# Altium project CAMERA.PrjPcb (part 1 of 3)
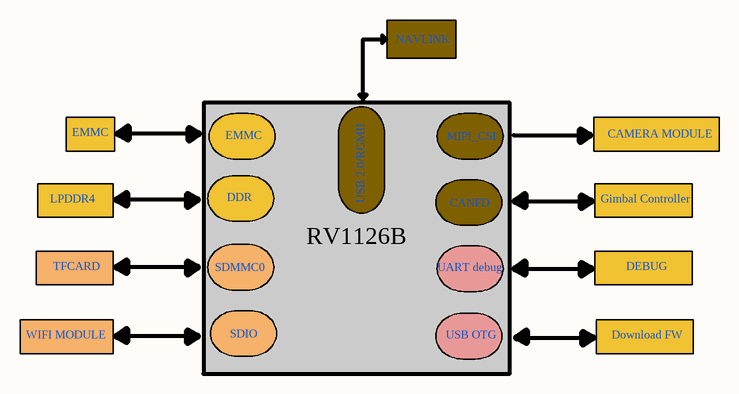
[diagram p0: Block Diagram.SchDoc]
21 sheets, 318 parts. Net scope: global (net labels, ports and power ports of the same name join across sheets).
Board file: CAMERA.PcbDoc
Sheets:
  Block Diagram.SchDoc
  Power Blocks Diagram.SchDoc
  PWR_IN.SchDoc
  PMIC.SchDoc
  Power Pins Page RV1126.SchDoc
  PMUIO_BLOCK.SchDoc
  SDRAM RV1126B.SchDoc
  LPDDR4X SDRAM.SchDoc
  RV1126B EMMC.SchDoc
  EMMC CHIP.SchDoc
  SDMMC RV1126B.SchDoc
  SDCARD.SchDoc
  SDMMC1.SchDoc
  SARADC.SchDoc
  USB 2.0 CONTROLLER.SchDoc
  CANFD.SchDoc
  MIPI_CSI.SchDoc
  RGMII.SchDoc
  RGMII_PHY.SchDoc
  Connector.SchDoc
  OTHER.SchDoc

## Sheet Block Diagram.SchDoc: Interface Block Diagram
size A4; DrawnBy: ThanhQuoc; Revision: V01; SheetNumber: 1; SheetTotal: 18; Project: RV1126 CAMERA BOARD DESIGN

### Notes on the sheet
- NAVLINK
- EMMC
- MIPI_CSI
- CAMERA MODULE
- LPDDR4
- DDR
- USB 2.0/RGMII
- CANFD
- Gimbal Controller
- TFCARD
- SDMMC0
- RV1126B
- UART debug
- DEBUG
- WIFI MODULE
- SDIO
- USB OTG
- Download FW
- Title:
- Drawn By:
- Page Contents:
- Checked By:
- Size:
- Date:
- File:
- License:
- Email:
- A4
- nguyenthanhquoc0206@gmail.com
- Number:
- Time:
- Revision:
- Sheet
- Website:
- of
- https://www.facebook.com/ntq.687

## Sheet Power Blocks Diagram.SchDoc: POWER BLOCKS DIAGRAM
size A4; DrawnBy: ThanhQuoc; Revision: V01; SheetNumber: 2; SheetTotal: 4; Project: RV1126 CAMERA BOARD DESIGN
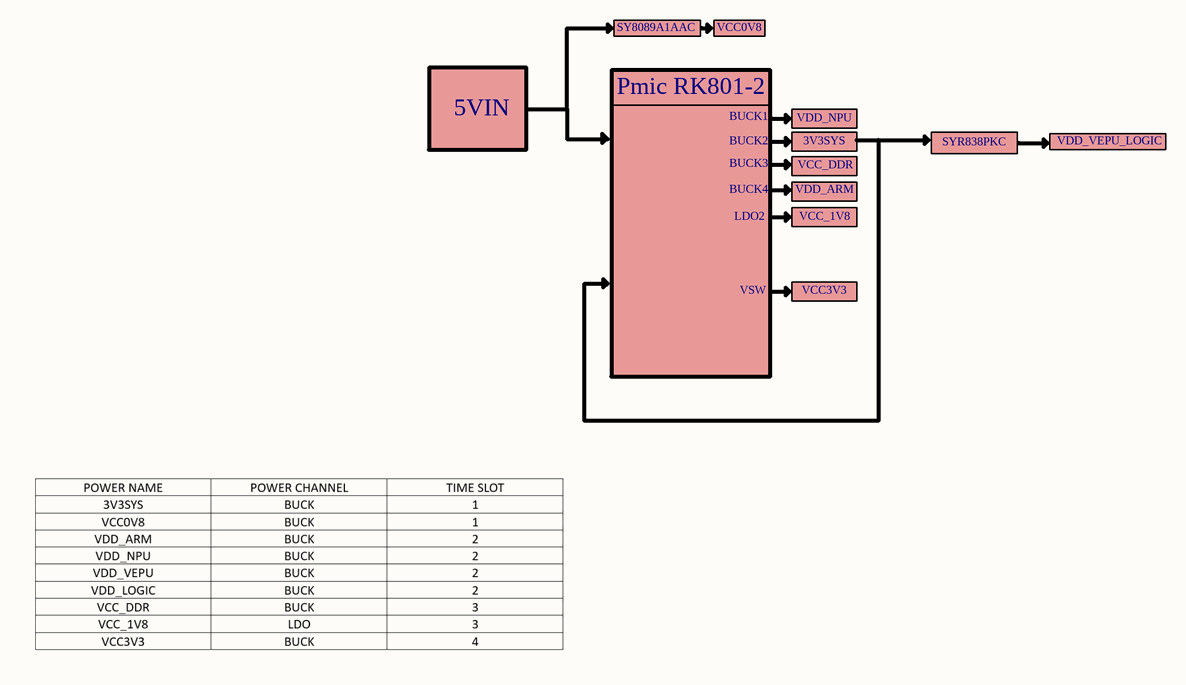
[diagram p1: Power Blocks Diagram.SchDoc]

### Notes on the sheet
- SY8089A1AAC
- VCC0V8
- 5VIN
- Pmic RK801-2
- BUCK1
- BUCK2
- VDD_NPU
- 3V3SYS
- SYR838PKC
- VDD_VEPU_LOGIC
- BUCK3
- BUCK4
- VDD_ARM
- VCC_DDR
- LDO2
- VCC_1V8
- VSW
- VCC3V3
- Title:
- Drawn By:
- Page Contents:
- Checked By:
- Size:
- Date:
- File:
- License:
- Email:
- A4
- nguyenthanhquoc0206@gmail.com
- Number:
- Time:
- Revision:
- Sheet
- Website:
- of
- https://www.facebook.com/ntq.687

## Sheet PWR_IN.SchDoc: POWER
size A4; DrawnBy: ThanhQuoc; Organization: ORGANIZATION; Address1: ADDRESS 1; Address2: ADDRESS 2; Address3: ADDRESS 3; Address4: ADDRESS 4; Revision: V01; SheetNumber: 3; SheetTotal: 21; Project: RV1126 CAMERA BOARD DESIGN; ENG_APP_DATE: --/--/--; DSN_APP_DATE: --/--/--; ImagePath: "C:\Users\Admin\Downloads\Gemini_Generated_Image_ajh2r8ajh2r8ajh2.png"
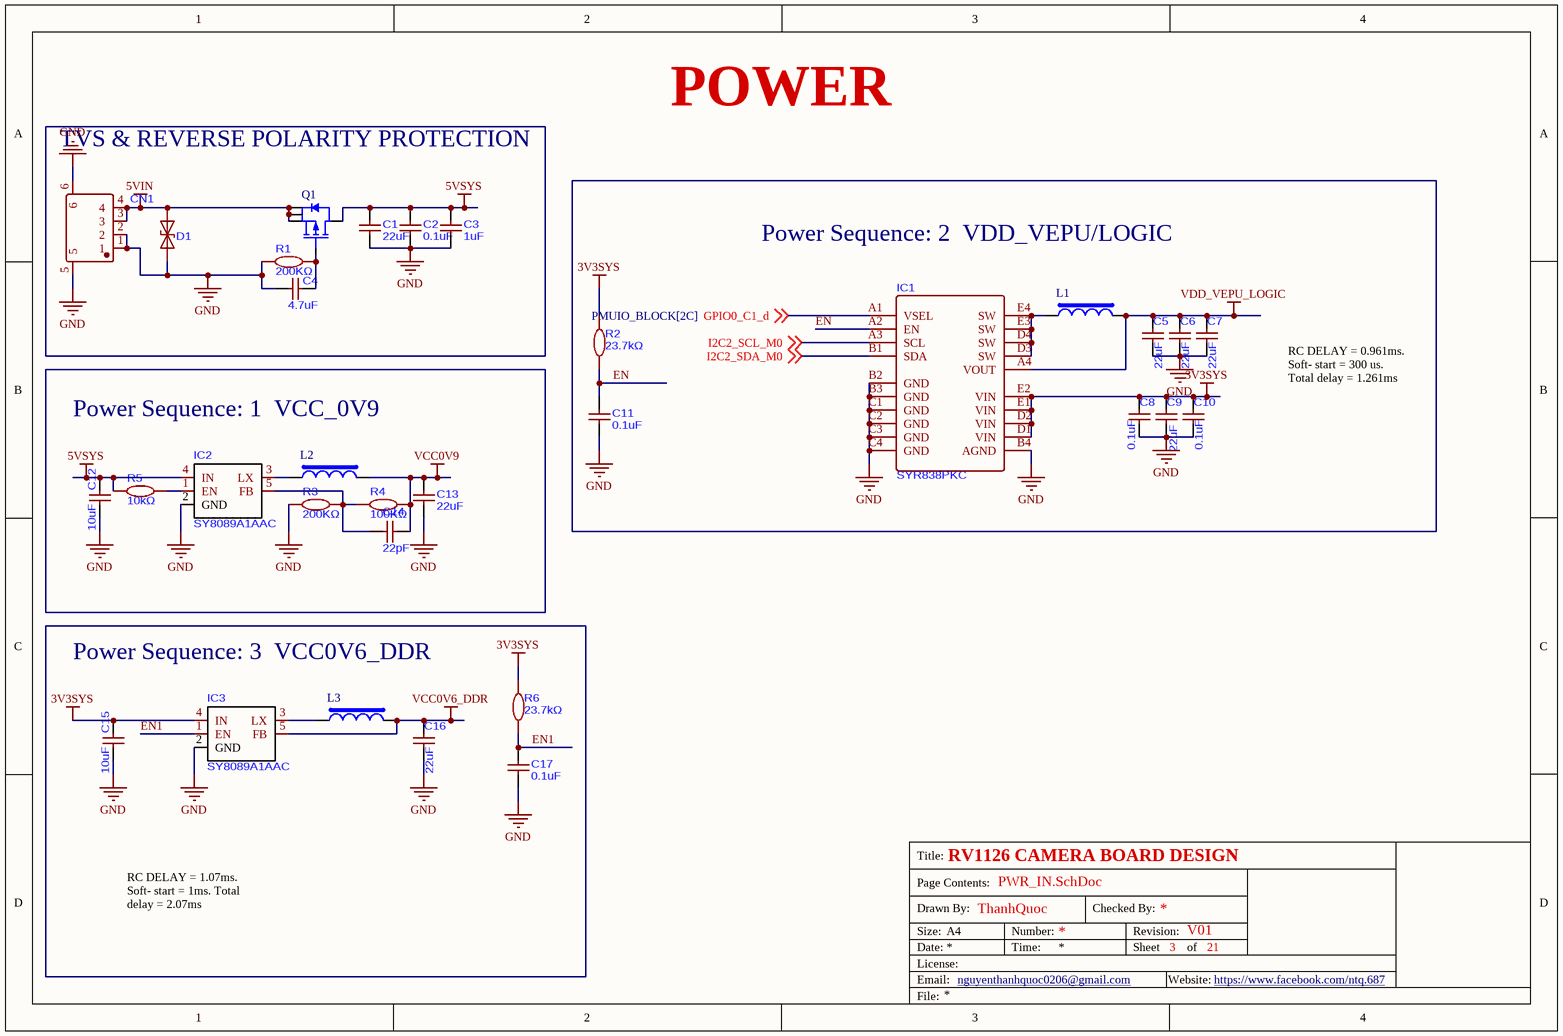
[diagram p2: PWR_IN.SchDoc]

### Parts
C1  22uF  [C0603]
C2  0.1uF  [C0201]
C3  1uF  [C0201]
C4  4.7uF  [C0402]
C5  22uF  [C0402]
C6  22uF  [C0402]
C7  22uF  [C0402]
C8  0.1uF  [C0201]
C9  22uF  [C0603]
C10  0.1uF  [C0201]
C11  0.1uF  [C0201]
C12  10uF  [C0402]
C13  22uF  [C0402]
C14  22pF  [C0201]
C15  10uF  [C0402]
C16  22uF  [C0402]
C17  0.1uF  [C0201]
CN1  SMD,P=2mm,Surface Mount,Right Angle  [CONN-SMD_4P-P2.00_WTBA0-BH004]  (value not drawn)
D1  TVS DIODE 5VWM 10VC X1-SON-2(0.6x1)  [X1SON-2_L1.0-W0.6-P0.65-BI-1]  (value not drawn)
IC1  SYR838PKC  [BGA-20_L15.6-W2.0-R4-C6-P0.40-BL]
IC2  SY8089A1AAC  [SOT-23-5_L3.0-W1.7-P0.95-LS2.8-BR]
IC3  SY8089A1AAC  [SOT-23-5_L3.0-W1.7-P0.95-LS2.8-BR]
L1  FTC252012SR47MBCA  [IND_1008]  (value not drawn)
L2  APH252012C1R0MP01  [IND_1008]  (value not drawn)
L3  APH252012C1R0MP01  [IND_1008]  (value not drawn)
Q1  SI7615CDN-T1-GE3  [PowerPAK_1212-8_SMD]  (value not drawn)
R1  200KΩ  [R0201]
R2  23.7kΩ  [R0402]
R3  200KΩ  [R0201]
R4  100KΩ  [R0201]
R5  10kΩ  [R0201]
R6  23.7kΩ  [R0402]

### Nets
3V3SYS: C8.2 C9.2 C10.2 C15.2 IC1.D1(VIN) IC1.D2(VIN) IC1.E1(VIN) IC1.E2(VIN) IC3.4(IN) R2.2 R6.2
5VIN: CN1.3 CN1.4 D1.2(A) Q1.1(S) Q1.2(S) Q1.3(S)
5VSYS: C1.2 C2.2 C3.2 C12.2 IC2.4(IN) Q1.5(D) R5.1
GND: C1.1 C2.1 C3.1 C4.2 C5.1 C6.1 C7.1 C8.1 C9.1 C10.1 C11.1 C12.1 C13.1 C15.1 C16.1 C17.1 CN1.1 CN1.2 CN1.5 CN1.6 D1.1(K) IC1.B2(GND) IC1.B3(GND) IC1.B4(AGND) IC1.C1(GND) IC1.C2(GND) IC1.C3(GND) IC1.C4(GND) IC2.2(GND) IC3.2(GND) R1.1 R3.1
VCC0V6_DDR: C16.2 IC3.5(FB) L3.2
VCC0V9: C13.2 C14.2 L2.2 R4.2
VDD_VEPU_LOGIC: C5.2 C6.2 C7.2 IC1.A4(VOUT) L1.2
EN: C11.2 IC1.A2(EN) R2.1
EN1: C17.2 IC3.1(EN) R6.1
GPIO0_C1_d: IC1.A1(VSEL) ; off-sheet GPIO0_C1_d
I2C2_SCL_M0: IC1.A3(SCL) ; off-sheet I2C2_SCL_M0  [project net SCL]
I2C2_SDA_M0: IC1.B1(SDA) ; off-sheet I2C2_SDA_M0  [project net SDA]
NetC4_1: C4.1 Q1.4(G) R1.2
NetC14_1: C14.1 IC2.5(FB) R3.2 R4.1
NetIC1_D3: IC1.D3(SW) IC1.D4(SW) IC1.E3(SW) IC1.E4(SW) L1.1
NetIC2_1: IC2.1(EN) R5.2
NetIC2_3: IC2.3(LX) L2.1
NetIC3_3: IC3.3(LX) L3.1

### Notes on the sheet
- TVS & REVERSE POLARITY PROTECTION
- Power Sequence: 2  VDD_VEPU/LOGIC
- Power Sequence: 1  VCC_0V9
- RC DELAY = 0.961ms. Soft- start = 300 us. Total delay = 1.261ms
- Power Sequence: 3  VCC0V6_DDR
- RC DELAY = 1.07ms. Soft- start = 1ms. Total delay = 2.07ms
- Title:
- Drawn By:
- Page Contents:
- Checked By:
- Size:
- Date:
- File:
- License:
- Email:
- A4
- nguyenthanhquoc0206@gmail.com
- Number:
- Time:
- Revision:
- Sheet
- Website:
- of
- https://www.facebook.com/ntq.687

### Library data of the parts
C1 = CAP_22uF-25V-20%-0603: 22uF ±20% 25V Ceramic Capacitor X5R 0603
C2 C8 C10 C11 C17 = CAP_100nF-16V-10%-0201: CAP CER 100nF 16V X5R 0201
C3 = CAP_1uF-10V-10%-0201: 1uF ±10% 10V Ceramic Capacitor X5R 0201
C4 = CAP_4.7uF-16V-10%-0402: 4.7uF ±10% 16V Ceramic Capacitor X5R 0402
C5-C7 C13 C16 = CAP_22uF-10V-20%-0402: 22uF X5R ±20% 10V 0402 Ceramic Capacitors RoHS; ComponentLink1Description: LCSC; ComponentLink1URL: https://www.lcsc.com/product-detail/C385994.html?s_z=n_q_t_22UF&spm=wm.fly.bg.2.xh___wm.ssy.tc.2.tz&lcsc_vid=EwRWBFZSQVIPVFdUTlJfVldeFFRYUFQAElRYBFRRE1MxVlNeRFZbX1BRRVlbVDsOAxUeFF5JWBYZEEoKFBINSQcJGk4NBhADEA4cHktXRlhXSQwSGg0%3D
C9 = CAP_22uF-16V-20%-0603: 22uF ±20% 16V Ceramic Capacitor X5R 0603
C12 C15 = CAP_10uF-10V-20%-0402: 10µF ±20% 10V Ceramic Capacitor X5R 0402 (1005 Metric)
C14 = CAP_22pF-50V-5%-0201: CAP CER 22pF 50V NP0 0201
CN1 = 5023520401: DuraClik(MX 2.0) 125V 4 1 2mm 3A Surface Mount, Right Angle Tin -40℃~+105℃ 4P Black 1x4P SMD,P=2mm,Surface Mount,Right Angle Headers, Male Pins RoHS
D1 = LTVS8H5.0CAT5G
IC1 = SYR838PKC: High-efficiency 5.5V, 6A, 2.4MHz synchronous buck regulator
IC2 IC3 = SY8089A1AAC: High Efficiency, 1.5MHz, 2A Synchronous Step Down Regulator; ComponentLink1Description: LCSC; ComponentLink1URL: https://www.lcsc.com/product-detail/C479074.html?s_z=n_q_SY8089A&spm=wm.fly.bg.0.xh&lcsc_vid=EwRWBFZSQVIPVFdUTlJfVldeFFRYUFQAElRYBFRRE1MxVlNeRVlcV1JUT1FeXzsOAxUeFF5JWBYZEEoKFBINSQcJGk4NBhADEA4cHktXR1NXSQwSGg0%3D
L1 = IND_470nH-6.5A-20%-1008: FIXED IND 0.47uH 6.5A 13mΩ SMD,2x2.5mm; Manufacturer: Murata Electronics; Manufacturer Part Number: DFE252010P-R47M=P2; Case/Package: 1008; Supplier-1: Digikey
L2 L3 = IND_1uH-4A-20%-1008: FIXED IND 01uH 4A 35mΩ SMD,2x2.5mm; Manufacturer: Murata Electronics; Manufacturer Part Number: DFE252010P-R47M=P2; Case/Package: 1008; Supplier-1: Digikey
Q1 = SI7615CDN-T1-GE3-MS: 22W 20V 60A 700mV 7mΩ@4.5V 1 P-Channel P-Channel DFN-8L(3x3) Single FETs, MOSFETs RoHS; Manufacturer: Vishay Siliconix; Manufacturer Part Number: SI7615CDN-T1-GE3; Case/Package: PowerPAK® 1212-8; Supplier-1: Digikey
R1 R3 = RES_200K-50mW-1%-0201: RES 200kΩ ±1% 50mW 0201
R2 R6 = RES_23.7K-0.063W-0.1%-0402: RES 23700Ω ±0.1% 0.063W 0402; ComponentLink1Description: LCSC; ComponentLink1URL: https://www.lcsc.com/product-detail/C2076022.html?s_z=n_q_t_23.7K&spm=wm.fly.bg.0.xh___wm.ssy.tc.0.tz&lcsc_vid=EwRWBFZSQVIPVFdUTlJfVldeFFRYUFQAElRYBFRRE1MxVlNeRFdWV1xeQVRYUzsOAxUeFF5JWBYZEEoKFBINSQcJGk4NBhADEA4cHktXR1NXSQwSGg0%3D
R4 = RES_100K-50mW-1%-0201: RES 100kΩ ±1% 50mW 0201; ComponentLink1Description: LCSC; ComponentLink1URL: https://www.lcsc.com/product-detail/C295718.html?s_z=n_q_t_120%2520OHM&spm=wm.fly.bg.5.xh___wm.ssy.tc.1.tz&lcsc_vid=EwRWBFZSQVIPVFdUTlJfVldeFFRYUFQAElRYBFRRE1MxVlNeRFZeU1BfTlBYVzsOAxUeFF5JWBYZEEoKFBINSQcJGk4eFQsCAgIaSgADAwAHC0slRVhcV1ZTT08GEwkK
R5 = RES_10K-50mW-1%-0201: RES 10KΩ ±1% 50mW 0201; ComponentLink1Description: LCSC; ComponentLink1URL: https://www.lcsc.com/product-detail/C93949.html?spm=wm.fly.bg.0.xh&lcsc_vid=EwRWBFZSQVIPVFdUTlJfVldeFFRYUFQAElRYBFRRE1MxVlNeRVlXUFNQQ1RWXjsOAxUeFF5JWBYZEEoKFBINSQcJGk4eFQsCAgIaSgADAwAHC0slRlVYUFFIHxUDCw%3D%3D

## Sheet PMIC.SchDoc: PMIC
size A4; DrawnBy: ThanhQuoc; Revision: V01; SheetNumber: 4; SheetTotal: 21; Project: RV1126 CAMERA BOARD DESIGN
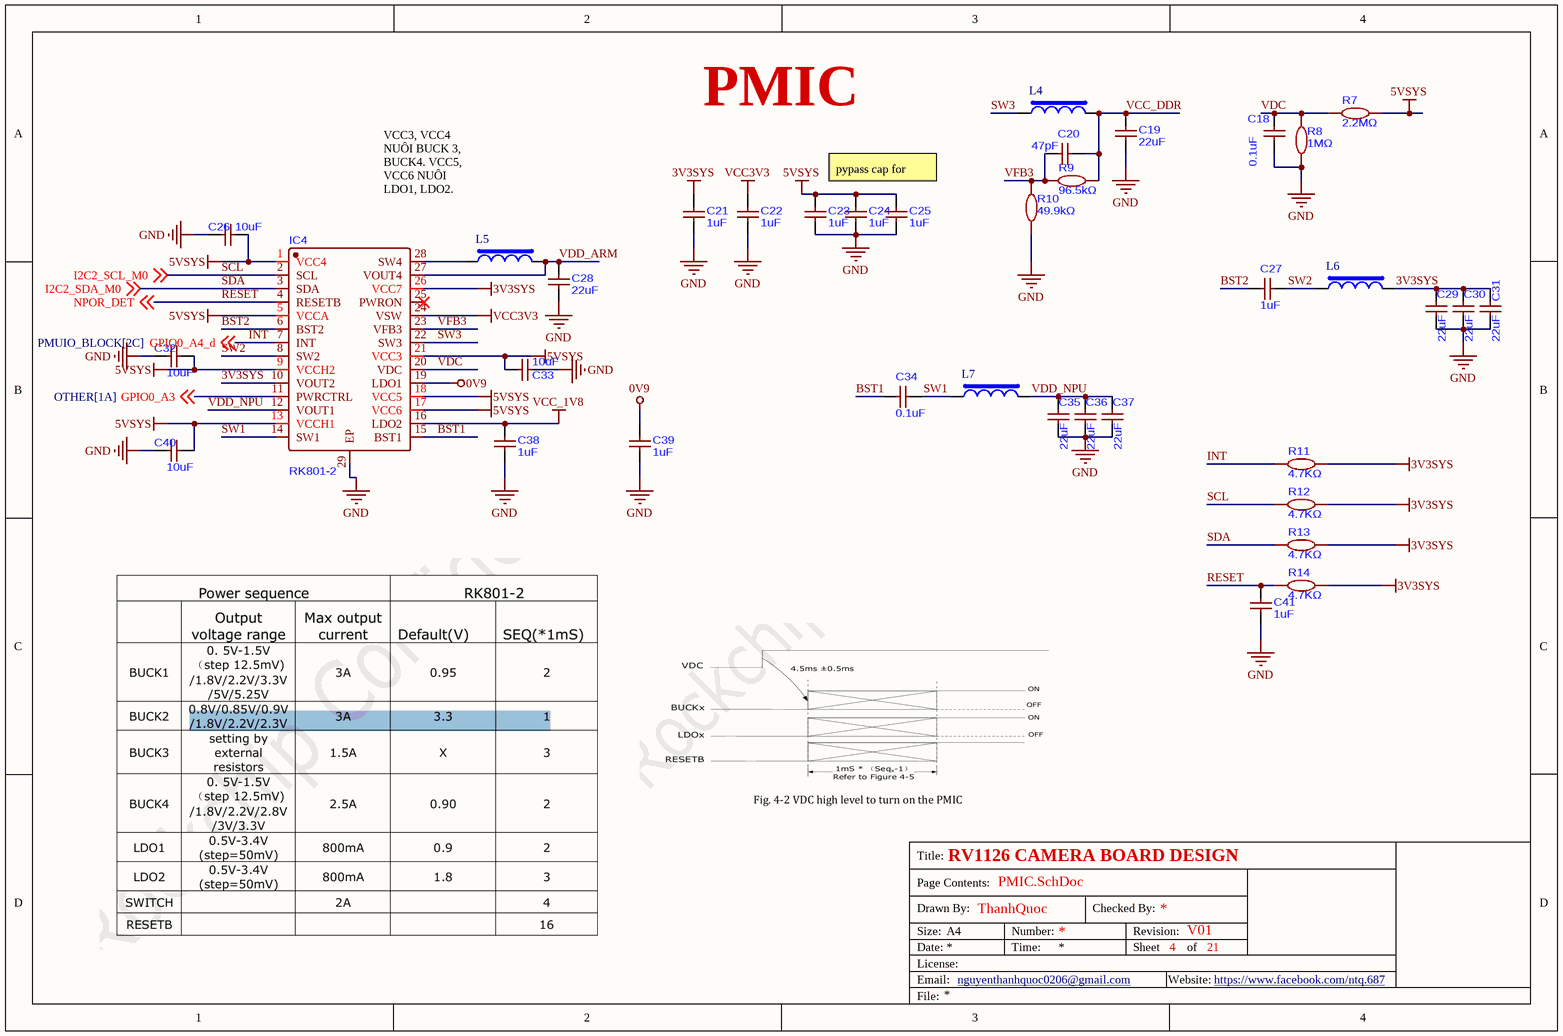
[diagram p3: PMIC.SchDoc]

### Parts
C18  0.1uF  [C0201]
C19  22uF  [C0603]
C20  47pF  [C0201]
C21  1uF  [C0201]
C22  1uF  [C0201]
C23  1uF  [C0201]
C24  1uF  [C0201]
C25  1uF  [C0201]
C26  10uF  [C0402]
C27  1uF  [C0201]
C28  22uF  [C0603]
C29  22uF  [C0402]
C30  22uF  [C0402]
C31  22uF  [C0402]
C32  10uF  [C0402]
C33  10uF  [C0402]
C34  0.1uF  [C0201]
C35  22uF  [C0402]
C36  22uF  [C0402]
C37  22uF  [C0402]
C38  1uF  [C0201]
C39  1uF  [C0201]
C40  10uF  [C0402]
C41  1uF  [C0201]
IC4  RK801-2  [QFN-28_L4.0-W4.0-P0.40-TL-EP2.4]
L4  FTC252012SR47MBCA  [IND_1008]  (value not drawn)
L5  FTC252012SR47MBCA  [IND_1008]  (value not drawn)
L6  PSTMAA252012-2R2MB  [IND_1008]  (value not drawn)
L7  PSTMAA252012-2R2MB  [IND_1008]  (value not drawn)
R7  2.2MΩ  [R0402]
R8  1MΩ  [R0201]
R9  96.5kΩ  [R0402]
R10  49.9kΩ  [R0402]
R11  4.7KΩ  [R0201]
R12  4.7KΩ  [R0201]
R13  4.7KΩ  [R0201]
R14  4.7KΩ  [R0201]

### Nets
0V9: C39.2 IC4.19(LDO1)
3V3SYS: C21.2 C29.2 C30.2 C31.2 IC4.10(VOUT2) IC4.26(VCC7) L6.2 R11.2 R12.2 R13.2 R14.2
5VSYS: C23.2 C24.2 C25.2 C26.2 C32.1 C33.2 C40.2 IC4.1(VCC4) IC4.5(VCCA) IC4.9(VCCH2) IC4.13(VCCH1) IC4.17(VCC6) IC4.18(VCC5) IC4.21(VCC3) R7.2
GND: C18.1 C19.1 C21.1 C22.1 C23.1 C24.1 C25.1 C26.1 C28.1 C29.1 C30.1 C31.1 C32.2 C33.1 C35.1 C36.1 C37.1 C38.1 C39.1 C40.1 C41.1 IC4.29(EP) R8.1 R10.1
VCC3V3: C22.2 IC4.24(VSW)
VCC_1V8: C38.2 IC4.16(LDO2)
VCC_DDR: C19.2 C20.2 L4.2 R9.2
VDD_ARM: C28.2 IC4.27(VOUT4) L5.2
VDD_NPU: C35.2 C36.2 C37.2 IC4.12(VOUT1) L7.2
BST1: C34.1 IC4.15(BST1)
BST2: C27.2 IC4.6(BST2)
GPIO0_A3: IC4.11(PWRCTRL) ; off-sheet GPIO0_A3
INT: IC4.7(INT) R11.1 ; off-sheet GPIO0_A4_d  [also labelled GPIO0_A4_d]
RESET: C41.2 IC4.4(RESETB) R14.1 ; off-sheet NPOR_DET  [also labelled NPOR_DET]
SCL: IC4.2(SCL) R12.1 ; off-sheet I2C2_SCL_M0  [also labelled I2C2_SCL_M0]
SDA: IC4.3(SDA) R13.1 ; off-sheet I2C2_SDA_M0  [also labelled I2C2_SDA_M0]
SW1: C34.2 IC4.14(SW1) L7.1
SW2: C27.1 IC4.8(SW2) L6.1
SW3: IC4.22(SW3) L4.1
VDC: C18.2 IC4.20(VDC) R7.1 R8.2
VFB3: C20.1 IC4.23(VFB3) R9.1 R10.2
NetIC4_28: IC4.28(SW4) L5.1

Not connected (* = marked no-connect by the designer): IC4 25(PWRON)*

### Notes on the sheet
- pypass cap for VCC5, VCC6, VCC7, VCCA
- VCC3, VCC4 NUÔI BUCK 3, BUCK4. VCC5, VCC6 NUÔI LDO1, LDO2. VCC7 NUÔI SW. VCCH1, VCCH2 NUÔI BUCK1, BUCK2
- Title:
- Drawn By:
- Page Contents:
- Checked By:
- Size:
- Date:
- File:
- License:
- Email:
- A4
- nguyenthanhquoc0206@gmail.com
- Number:
- Time:
- Revision:
- Sheet
- Website:
- of
- https://www.facebook.com/ntq.687

### Library data of the parts
C18 C34 = CAP_100nF-16V-10%-0201: CAP CER 100nF 16V X5R 0201
C19 C28 = CAP_22uF-16V-20%-0603: 22uF ±20% 16V Ceramic Capacitor X5R 0603
C20 = CAP_47pF-50V-5%-0201: CAP CER  47pF ±5% 50V C0G 0201
C21-C25 C27 C38 C39 C41 = CAP_1uF-10V-10%-0201: 1uF ±10% 10V Ceramic Capacitor X5R 0201
C26 C32 C33 C40 = CAP_10uF-10V-20%-0402: as C12 on sheet PWR_IN
C29-C31 C35-C37 = CAP_22uF-10V-20%-0402: as C5 on sheet PWR_IN; ComponentLink1Description: LCSC; ComponentLink1URL: https://www.lcsc.com/product-detail/C385994.html?s_z=n_q_t_22UF&spm=wm.fly.bg.2.xh___wm.ssy.tc.2.tz&lcsc_vid=EwRWBFZSQVIPVFdUTlJfVldeFFRYUFQAElRYBFRRE1MxVlNeRFZbX1BRRVlbVDsOAxUeFF5JWBYZEEoKFBINSQcJGk4NBhADEA4cHktXRlhXSQwSGg0%3D
IC4 = RK801-2: I2C QFN-28-EP(4x4) Power Management - Specialized RoHS
L4 L5 = IND_470nH-6.5A-20%-1008: as L1 on sheet PWR_IN; Case/Package: 1008; Supplier-1: Digikey
L6 L7 = IND_2.2uH-4.1A-20%-1008: 2.2uH Shielded Wirewound Inductor 4.1A 60mOhm Max 1008 (2520 Metric); Manufacturer: Murata Electronics; Manufacturer Part Number: DFE252010-R47M=P2; Case/Package: 1008; Supplier-1: Digikey; ComponentLink1Description: LCSC; ComponentLink1URL: https://www.lcsc.com/product-detail/C45385204.html?s_z=n_q_t_2.2UH&spm=wm.fly.bg.0.xh___wm.ssy.tc.0.tz&lcsc_vid=EwRWBFZSQVIPVFdUTlJfVldeFFRYUFQAElRYBFRRE1MxVlNeRVlWUV1XQ1hZVjsOAxUeFF5JWBYZEEoKFBINSQcJGk4NBhADEA4cHktXRlVcSQwSGg0%3D
R7 = RES_2.2M-62.5W-1%-0402: RES 2.2MΩ ±1% 62.5mW 0402; ComponentLink1Description: LCSC; ComponentLink1URL: https://www.lcsc.com/product-detail/C2998080.html?spm=wm.fly.bg.0.xh&lcsc_vid=EwRWBFZSQVIPVFdUTlJfVldeFFRYUFQAElRYBFRRE1MxVlNeRVlXUFNQQ1RWXjsOAxUeFF5JWBYZEEoKFBINSQcJGk4eFQsCAgIaSgADAwAHC0slRlVYUFFIHxUDCw%3D%3D
R8 = RES_1M-50mW-0.1%-0201: RES 1MΩ ±0.1% 50mW 0201; ComponentLink1Description: LCSC; ComponentLink1URL: https://www.lcsc.com/product-detail/C93949.html?spm=wm.fly.bg.0.xh&lcsc_vid=EwRWBFZSQVIPVFdUTlJfVldeFFRYUFQAElRYBFRRE1MxVlNeRVlXUFNQQ1RWXjsOAxUeFF5JWBYZEEoKFBINSQcJGk4eFQsCAgIaSgADAwAHC0slRlVYUFFIHxUDCw%3D%3D
R9 = RES_96.5K-0.1W-0.1%-0402: RES 96.5kΩ ±0.1% 62.5mW 0402; ComponentLink1Description: LCSC; ComponentLink1URL: https://www.lcsc.com/product-detail/C852962.html?s_z=n_q_t_96.5k&spm=wm.fly.bg.0.xh___wm.ssy.tc.0.tz&lcsc_vid=EwRWBFZSQVIPVFdUTlJfVldeFFRYUFQAElRYBFRRE1MxVlNeRFdZVVBVQ1VfVzsOAxUeFF5JWBYZEEoKFBINSQcJGk4dAgUUFAk%3D
R10 = RES_49.9K-0.1W-0.1%-0402: RES 49.9kΩ ±0.1% 62.5mW 0402; ComponentLink1Description: LCSC; ComponentLink1URL: https://www.lcsc.com/product-detail/C852808.html?spm=wm.fly.bg.1.xh&lcsc_vid=EwRWBFZSQVIPVFdUTlJfVldeFFRYUFQAElRYBFRRE1MxVlNeRFdZVVFWTlNbVTsOAxUeFF5JWBYZEEoKFBINSQcJGk4eFQsCAgIaSgADAwAHC0slT1RcXlJUWQkaCgg%3D
R11-R14 = RES_4.7K-50mW-1%-0201: RES 4.7kΩ ±1% 50mW 0201; ComponentLink1Description: LCSC; ComponentLink1URL: https://www.lcsc.com/product-detail/C295718.html?s_z=n_q_t_120%2520OHM&spm=wm.fly.bg.5.xh___wm.ssy.tc.1.tz&lcsc_vid=EwRWBFZSQVIPVFdUTlJfVldeFFRYUFQAElRYBFRRE1MxVlNeRFZeU1BfTlBYVzsOAxUeFF5JWBYZEEoKFBINSQcJGk4eFQsCAgIaSgADAwAHC0slRVhcV1ZTT08GEwkK

## Sheet Power Pins Page RV1126.SchDoc: Power Of CPU
size A4 portrait; DrawnBy: ThanhQuoc; Revision: V01; SheetNumber: 5; SheetTotal: 21; Project: RV1126 CAMERA BOARD DESIGN
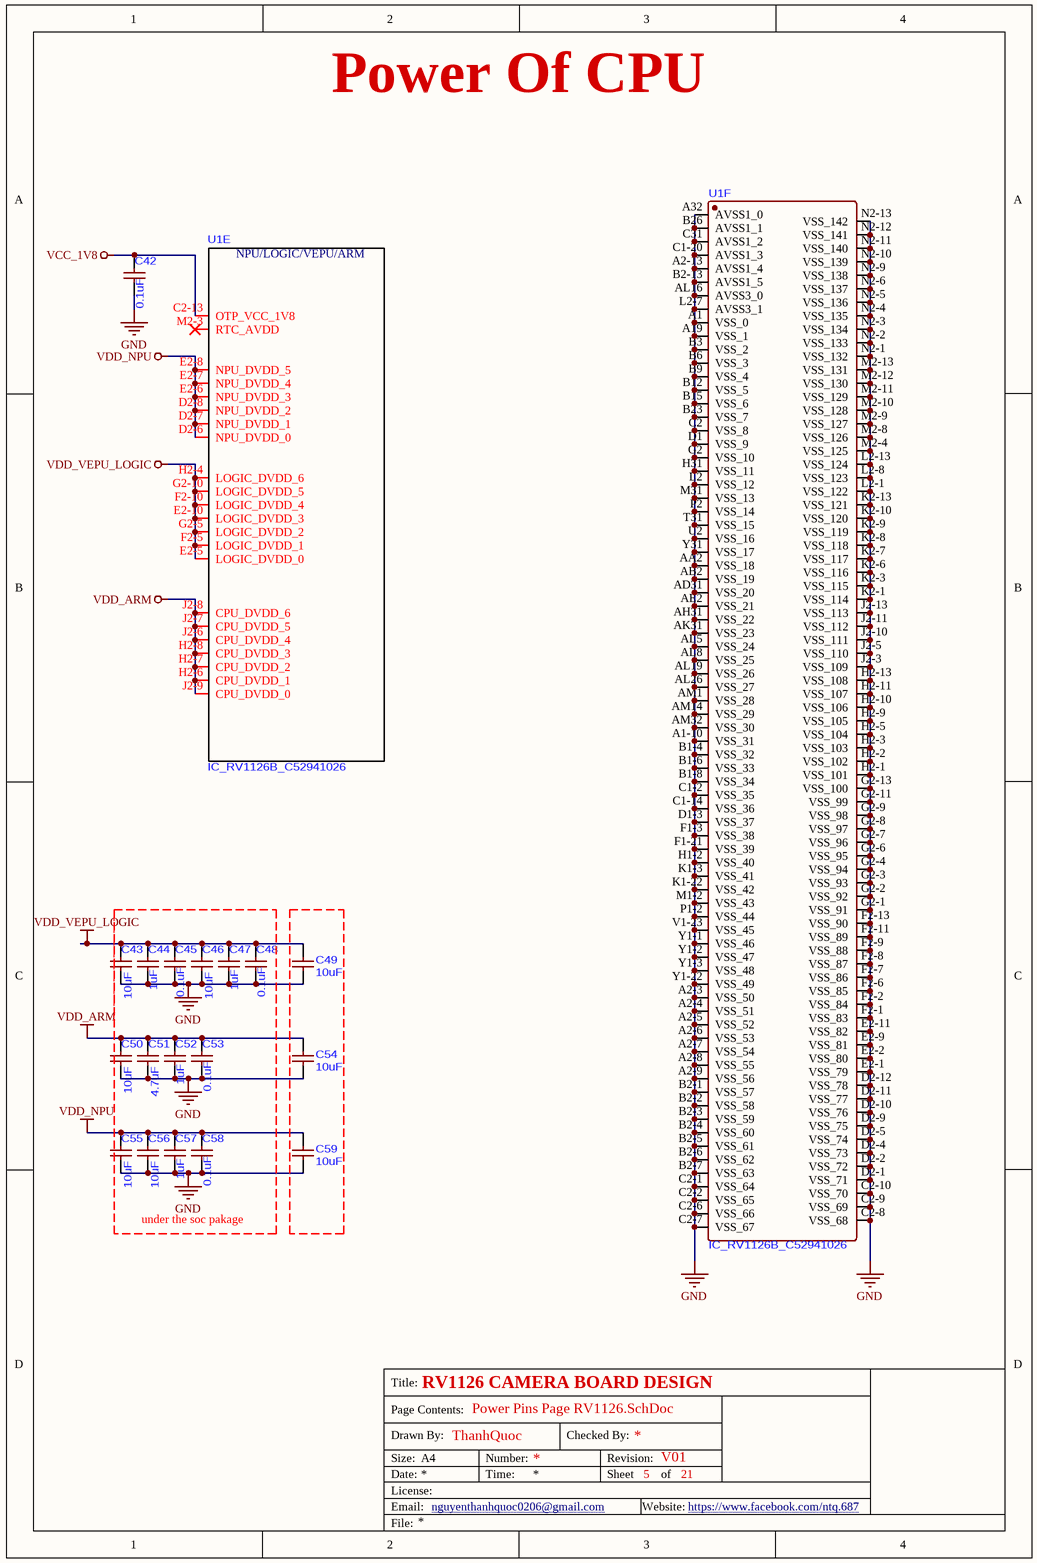
[diagram p4: Power Pins Page RV1126.SchDoc]

### Parts
C42  0.1uF  [C0201]
C43  10uF  [C0402]
C44  1uF  [C0201]
C45  0.1uF  [C0201]
C46  10uF  [C0402]
C47  1uF  [C0201]
C48  0.1uF  [C0201]
C49  10uF  [C0402]
C50  10uF  [C0402]
C51  4.7uF  [C0402]
C52  1uF  [C0201]
C53  0.1uF  [C0201]
C54  10uF  [C0402]
C55  10uF  [C0402]
C56  10uF  [C0402]
C57  1uF  [C0201]
C58  0.1uF  [C0201]
C59  10uF  [C0402]
U1  IC_RV1126B_C52941026  [CCSP-491_L14.0-W14.0-TL_RV1126B]  (parts E,F of 18)

### Nets
GND: C42.1 C43.1 C44.1 C45.1 C46.1 C47.1 C48.1 C49.1 C50.1 C51.1 C52.1 C53.1 C54.1 C55.1 C56.1 C57.1 C58.1 C59.1 U1.A1(VSS_0) U1.A1-10(VSS_31) U1.A2-3(VSS_50) U1.A2-4(VSS_51) U1.A2-5(VSS_52) U1.A2-6(VSS_53) U1.A2-7(VSS_54) U1.A2-8(VSS_55) U1.A2-9(VSS_56) U1.A2-13(AVSS1_4) U1.A19(VSS_1) U1.A32(AVSS1_0) U1.AA2(VSS_18) U1.AB2(VSS_19) U1.AD31(VSS_20) U1.AE2(VSS_21) U1.AH31(VSS_22) U1.AK31(VSS_23) U1.AL5(VSS_24) U1.AL8(VSS_25) U1.AL16(AVSS3_0) U1.AL19(VSS_26) U1.AL26(VSS_27) U1.AM1(VSS_28) U1.AM14(VSS_29) U1.AM32(VSS_30) U1.B1-4(VSS_32) U1.B1-6(VSS_33) U1.B1-8(VSS_34) U1.B2-1(VSS_57) U1.B2-2(VSS_58) U1.B2-3(VSS_59) U1.B2-4(VSS_60) U1.B2-5(VSS_61) U1.B2-6(VSS_62) U1.B2-7(VSS_63) U1.B2-13(AVSS1_5) U1.B3(VSS_2) U1.B6(VSS_3) U1.B9(VSS_4) U1.B12(VSS_5) U1.B15(VSS_6) U1.B23(VSS_7) U1.B26(AVSS1_1) U1.C1-2(VSS_35) U1.C1-14(VSS_36) U1.C1-20(AVSS1_3) U1.C2(VSS_8) U1.C2-1(VSS_64) U1.C2-2(VSS_65) U1.C2-6(VSS_66) U1.C2-7(VSS_67) U1.C2-8(VSS_68) U1.C2-9(VSS_69) U1.C2-10(VSS_70) U1.C31(AVSS1_2) U1.D1(VSS_9) U1.D1-3(VSS_37) U1.D2-1(VSS_71) U1.D2-2(VSS_72) U1.D2-4(VSS_73) U1.D2-5(VSS_74) U1.D2-9(VSS_75) U1.D2-10(VSS_76) U1.D2-11(VSS_77) U1.D2-12(VSS_78) U1.E2-1(VSS_79) U1.E2-2(VSS_80) U1.E2-9(VSS_81) U1.E2-11(VSS_82) U1.F1-3(VSS_38) U1.F1-21(VSS_39) U1.F2-1(VSS_83) U1.F2-2(VSS_84) U1.F2-6(VSS_85) U1.F2-7(VSS_86) U1.F2-8(VSS_87) U1.F2-9(VSS_88) U1.F2-11(VSS_89) U1.F2-13(VSS_90) U1.G2(VSS_10) U1.G2-1(VSS_91) U1.G2-2(VSS_92) U1.G2-3(VSS_93) U1.G2-4(VSS_94) U1.G2-6(VSS_95) U1.G2-7(VSS_96) U1.G2-8(VSS_97) U1.G2-9(VSS_98) U1.G2-11(VSS_99) U1.G2-13(VSS_100) U1.H1-2(VSS_40) U1.H2-1(VSS_101) U1.H2-2(VSS_102) U1.H2-3(VSS_103) U1.H2-5(VSS_104) U1.H2-9(VSS_105) U1.H2-10(VSS_106) U1.H2-11(VSS_107) U1.H2-13(VSS_108) U1.H31(VSS_11) U1.J2-3(VSS_109) U1.J2-5(VSS_110) U1.J2-10(VSS_111) U1.J2-11(VSS_112) U1.J2-13(VSS_113) U1.K1-3(VSS_41) U1.K1-22(VSS_42) U1.K2-1(VSS_114) U1.K2-3(VSS_115) U1.K2-6(VSS_116) U1.K2-7(VSS_117) U1.K2-8(VSS_118) U1.K2-9(VSS_119) U1.K2-10(VSS_120) U1.K2-13(VSS_121) U1.L2(VSS_12) U1.L2-1(VSS_122) U1.L2-7(AVSS3_1) U1.L2-8(VSS_123) U1.L2-13(VSS_124) U1.M1-2(VSS_43) U1.M2-4(VSS_125) U1.M2-8(VSS_126) U1.M2-9(VSS_127) U1.M2-10(VSS_128) U1.M2-11(VSS_129) U1.M2-12(VSS_130) U1.M2-13(VSS_131) U1.M31(VSS_13) U1.N2-1(VSS_132) U1.N2-2(VSS_133) U1.N2-3(VSS_134) U1.N2-4(VSS_135) U1.N2-5(VSS_136) U1.N2-6(VSS_137) U1.N2-9(VSS_138) U1.N2-10(VSS_139) U1.N2-11(VSS_140) U1.N2-12(VSS_141) U1.N2-13(VSS_142) U1.P1-2(VSS_44) U1.P2(VSS_14) U1.T31(VSS_15) U1.U2(VSS_16) U1.V1-23(VSS_45) U1.Y1-1(VSS_46) U1.Y1-2(VSS_47) U1.Y1-3(VSS_48) U1.Y1-22(VSS_49) U1.Y31(VSS_17)
VCC_1V8: C42.2 U1.C2-13(OTP_VCC_1V8)
VDD_ARM: C50.2 C51.2 C52.2 C53.2 C54.2 U1.H2-6(CPU_DVDD_1) U1.H2-7(CPU_DVDD_2) U1.H2-8(CPU_DVDD_3) U1.J2-6(CPU_DVDD_4) U1.J2-7(CPU_DVDD_5) U1.J2-8(CPU_DVDD_6) U1.J2-9(CPU_DVDD_0)
VDD_NPU: C55.2 C56.2 C57.2 C58.2 C59.2 U1.D2-6(NPU_DVDD_0) U1.D2-7(NPU_DVDD_1) U1.D2-8(NPU_DVDD_2) U1.E2-6(NPU_DVDD_3) U1.E2-7(NPU_DVDD_4) U1.E2-8(NPU_DVDD_5)
VDD_VEPU_LOGIC: C43.2 C44.2 C45.2 C46.2 C47.2 C48.2 C49.2 U1.E2-5(LOGIC_DVDD_0) U1.E2-10(LOGIC_DVDD_3) U1.F2-5(LOGIC_DVDD_1) U1.F2-10(LOGIC_DVDD_4) U1.G2-5(LOGIC_DVDD_2) U1.G2-10(LOGIC_DVDD_5) U1.H2-4(LOGIC_DVDD_6)

Not connected (* = marked no-connect by the designer): U1 M2-3(RTC_AVDD)*

### Notes on the sheet
- under the soc pakage
- Title:
- Drawn By:
- Page Contents:
- Checked By:
- Size:
- Date:
- File:
- License:
- Email:
- A4
- nguyenthanhquoc0206@gmail.com
- Number:
- Time:
- Revision:
- Sheet
- Website:
- of
- https://www.facebook.com/ntq.687
- (in symbol IC_RV1126B_C52941026, part E) NPU/LOGIC/VEPU/ARM

### Library data of the parts
C42 C45 C48 C53 C58 = CAP_100nF-6.3V-10%-0201_1: 0.1uF ±10% 6.3V Ceramic Capacitor X5R 0201
C43 C46 C49 C50 C54-C56 C59 = CAP_10uF-10V-20%-0402: as C12 on sheet PWR_IN
C44 C47 C52 C57 = CAP_1uF-6.3V-10%-0201: 1uF ±10% 6.3V Ceramic Capacitor X5R 0201
C51 = CAP_4.7uF-10V-10%-0402: 4.7µF ±10% 10V Ceramic Capacitor X5R 0402 (1005 Metric)

## Sheet PMUIO_BLOCK.SchDoc: OSC/PMU Controller
size A4; DrawnBy: ThanhQuoc; Revision: V01; SheetNumber: 6; SheetTotal: 21; Project: RV1126 CAMERA BOARD DESIGN
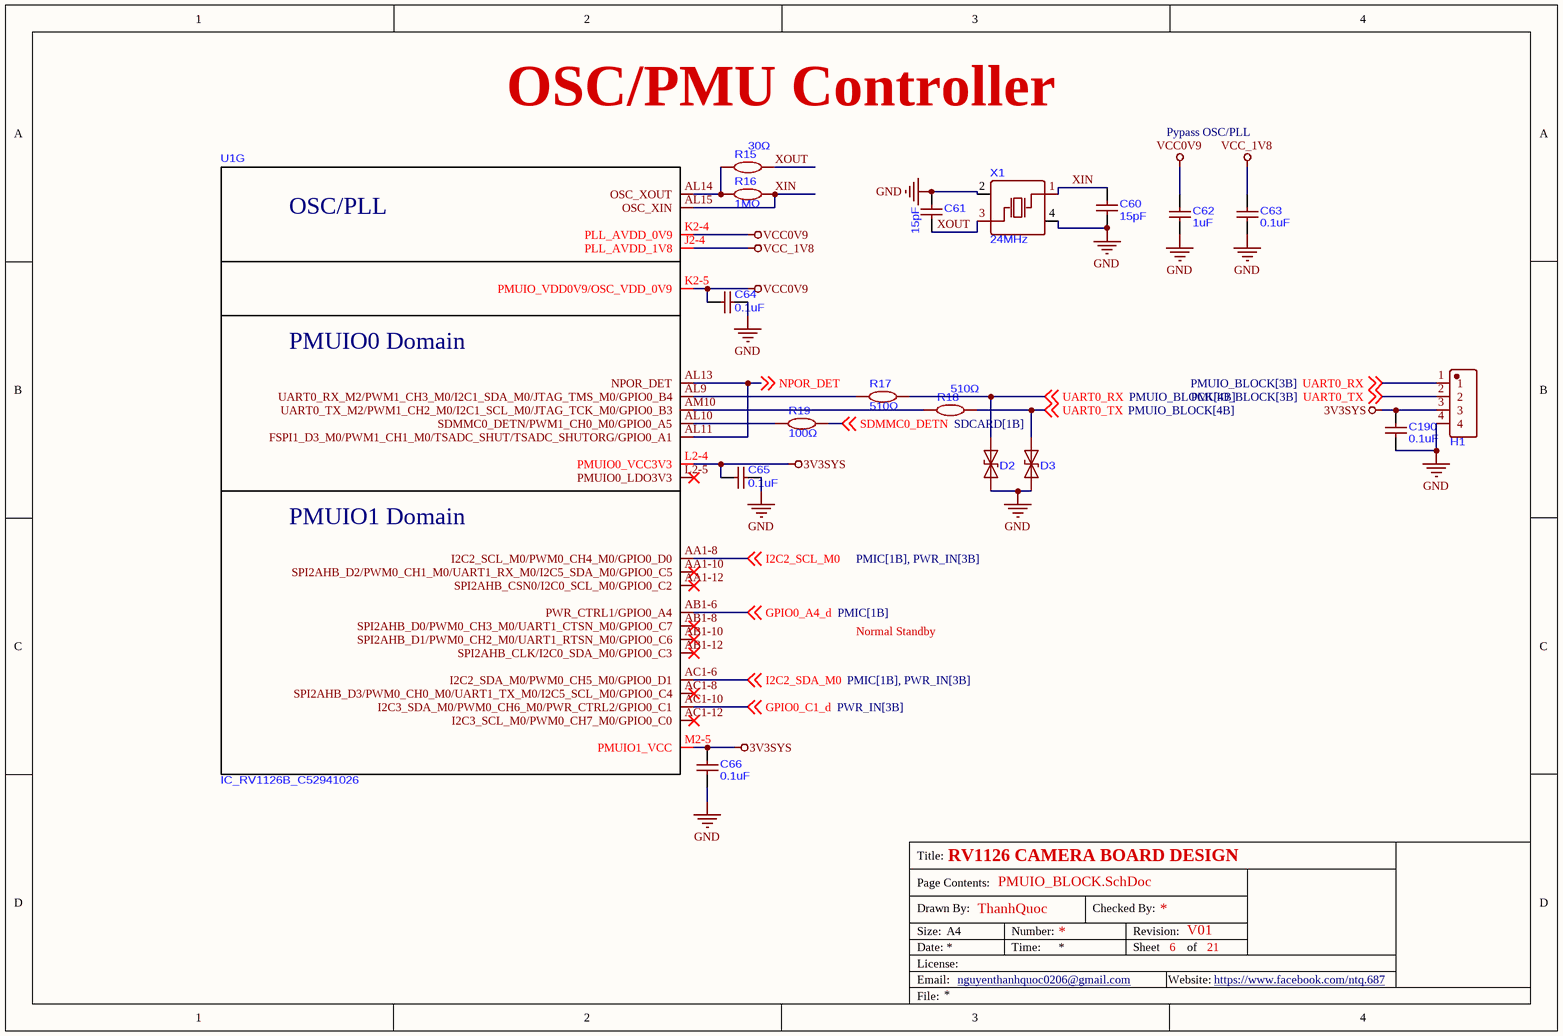
[diagram p5: PMUIO_BLOCK.SchDoc]

### Parts
C60  15pF  [C0201]
C61  15pF  [C0201]
C62  1uF  [C0201]
C63  0.1uF  [C0201]
C64  0.1uF  [C0201]
C65  0.1uF  [C0201]
C66  0.1uF  [C0201]
C190  0.1uF  [C0201]
D2  ESD DIODE  [DSN0603-2_L0.7-W0.3-P0.40-BI]  (value not drawn)
D3  ESD DIODE  [DSN0603-2_L0.7-W0.3-P0.40-BI]  (value not drawn)
H1  Through Hole,P=1.27mm  [HDR-TH_4P-P1.27-V-M]  (value not drawn)
R15  30Ω  [R0201]
R16  1MΩ  [R0201]
R17  510Ω  [R0201]
R18  510Ω  [R0201]
R19  100Ω  [R0201]
U1  IC_RV1126B_C52941026  [CCSP-491_L14.0-W14.0-TL_RV1126B]  (part G of 18)
X1  24MHz  [CRYSTAL-SMD_4P-L2.0-W1.6-BL]

### Nets
3V3SYS: C65.2 C66.2 C190.2 H1.3 U1.L2-4(PMUIO0_VCC3V3) U1.M2-5(PMUIO1_VCC)
GND: C60.1 C61.2 C62.1 C63.1 C64.1 C65.1 C66.1 C190.1 D2.1(K) D3.1(K) H1.4 X1.2(GND) X1.4(GND)
VCC0V9: C62.2 C64.2 U1.K2-4(PLL_AVDD_0V9) U1.K2-5(PMUIO_VDD0V9/OSC_VDD_0V9)
VCC_1V8: C63.2 U1.J2-4(PLL_AVDD_1V8)
GPIO0_A4_d: U1.AB1-6(PWR_CTRL1/GPIO0_A4) ; off-sheet GPIO0_A4_d  [project net INT]
GPIO0_C1_d: U1.AC1-10(I2C3_SDA_M0/PWM0_CH6_M0/PWR_CTRL2/GPIO0_C1) ; off-sheet GPIO0_C1_d
I2C2_SCL_M0: U1.AA1-8(I2C2_SCL_M0/PWM0_CH4_M0/GPIO0_D0) ; off-sheet I2C2_SCL_M0  [project net SCL]
I2C2_SDA_M0: U1.AC1-6(I2C2_SDA_M0/PWM0_CH5_M0/GPIO0_D1) ; off-sheet I2C2_SDA_M0  [project net SDA]
NPOR_DET: U1.AL11(FSPI1_D3_M0/PWM1_CH1_M0/TSADC_SHUT/TSADC_SHUTORG/GPIO0_A1) U1.AL13(NPOR_DET) ; off-sheet NPOR_DET  [project net RESET]
SDMMC0_DETN: R19.2 ; off-sheet SDMMC0_DETN
UART0_RX: D2.2(A) H1.1 R17.2 ; off-sheet UART0_RX
UART0_TX: D3.2(A) H1.2 R18.2 ; off-sheet UART0_TX
XIN: C60.2 R16.2 U1.AL15(OSC_XIN) X1.1(OSC1)
XOUT: C61.1 R15.2 X1.3(OSC2)
NetR15_1: R15.1 R16.1 U1.AL14(OSC_XOUT)
NetR17_1: R17.1 U1.AL9(UART0_RX_M2/PWM1_CH3_M0/I2C1_SDA_M0/JTAG_TMS_M0/GPIO0_B4)
NetR18_1: R18.1 U1.AM10(UART0_TX_M2/PWM1_CH2_M0/I2C1_SCL_M0/JTAG_TCK_M0/GPIO0_B3)
NetR19_1: R19.1 U1.AL10(SDMMC0_DETN/PWM1_CH0_M0/GPIO0_A5)

Not connected (* = marked no-connect by the designer): U1 AA1-10(SPI2AHB_D2/PWM0_CH1_M0/UART1_RX_M0/I2C5_SDA_M0/GPIO0_C5)* AA1-12(SPI2AHB_CSN0/I2C0_SCL_M0/GPIO0_C2)* AB1-8(SPI2AHB_D0/PWM0_CH3_M0/UART1_CTSN_M0/GPIO0_C7)* AB1-10(SPI2AHB_D1/PWM0_CH2_M0/UART1_RTSN_M0/GPIO0_C6)* AB1-12(SPI2AHB_CLK/I2C0_SDA_M0/GPIO0_C3)* AC1-8(SPI2AHB_D3/PWM0_CH0_M0/UART1_TX_M0/I2C5_SCL_M0/GPIO0_C4)* AC1-12(I2C3_SCL_M0/PWM0_CH7_M0/GPIO0_C0)* L2-5(PMUIO0_LDO3V3)*

### Notes on the sheet
- Pypass OSC/PLL
- Normal Standby
- Title:
- Drawn By:
- Page Contents:
- Checked By:
- Size:
- Date:
- File:
- License:
- Email:
- A4
- nguyenthanhquoc0206@gmail.com
- Number:
- Time:
- Revision:
- Sheet
- Website:
- of
- https://www.facebook.com/ntq.687
- (in symbol IC_RV1126B_C52941026, part G) OSC/PLL; PMUIO0 Domain; PMUIO1 Domain

### Library data of the parts
C60 C61 = CAP_15pF-25V-5%-0201: CAP CER 15pF 50V NP0 0201; ComponentLink1Description: LCSC; ComponentLink1URL: https://www.lcsc.com/product-detail/C277480.html?s_z=n_q_t_15PF&spm=wm.fly.bg.0.xh___wm.ssy.tc.0.tz&lcsc_vid=EwRWBFZSQVIPVFdUTlJfVldeFFRYUFQAElRYBFRRE1MxVlNeRFdcX11TTlBaVjsOAxUeFF5JWBYZEEoKFBINSQcJGk4NBhADEA4cHktXRlRZSQwSGg0%3D
C62 = CAP_1uF-6.3V-10%-0201: 1uF ±10% 6.3V Ceramic Capacitor X5R 0201
C63-C66 C190 = CAP_100nF-6.3V-10%-0201_1: as C42 on sheet Power Pins Page RV1126
D2 D3 = PESD5V0H1BSFYL: ESD DIODE 5VWM 5VC DSN0603-2 0.13PF
H1 = PZ127V-11-04-0720: Through Hole -40℃~+105℃ 2P 1A 4.3mm 1x2P 1.27mm Top 1 Square Hole Through Hole,P=1.27mm Headers, Receptacles, Female Sockets RoHS
R15 = RES_30Ω-0.05W-1%-0201: RES 30Ω ±1% 50mW 0201; ComponentLink1Description: LCSC; ComponentLink1URL: https://www.lcsc.com/product-detail/C320826.html?spm=wm.fly.bg.3.xh&lcsc_vid=EwRWBFZSQVIPVFdUTlJfVldeFFRYUFQAElRYBFRRE1MxVlNeRFdcXlNfT1JZVDsOAxUeFF5JWBYZEEoKFBINSQcJGk4eFQsCAgIaSgADAwAHC0slRlRbUFBVWQkaCgg%3D
R16 = RES_1M-0.1W-5%-0201: RES 1MΩ ±5% 50mW 0201; ComponentLink1Description: LCSC; ComponentLink1URL: https://www.lcsc.com/product-detail/C93949.html?spm=wm.fly.bg.0.xh&lcsc_vid=EwRWBFZSQVIPVFdUTlJfVldeFFRYUFQAElRYBFRRE1MxVlNeRVlXUFNQQ1RWXjsOAxUeFF5JWBYZEEoKFBINSQcJGk4eFQsCAgIaSgADAwAHC0slRlVYUFFIHxUDCw%3D%3D
R17 R18 = RES_510-0.05W-1%-0201: 510Ω 50mW 25V Thick Film Resistor ±200ppm/℃ ±1% 0201 Chip Resistor - Surface Mount RoHS
R19 = RES_100OHM-50mW-1%-0201: RES 100Ω ±1% 50mW 0201
X1 = XTAL_24Mhz-12pF-4-SMD: CRYSTAL 24MHz 12pF SMD; ComponentLink1Description: LCSC; ComponentLink1URL: https://www.lcsc.com/product-detail/C37635324.html?spm=wm.fly.bg.3.xh&lcsc_vid=EwRWBFZSQVIPVFdUTlJfVldeFFRYUFQAElRYBFRRE1MxVlNeRFdcUVxRR1BcVjsOAxUeFF5JWBYZEEoKFBINSQcJGk4eFQsCAgIaSgADAwAHC0slRVlaVlJXWQkaCgg%3D

## Sheet SDRAM RV1126B.SchDoc: LPDDR4 of CPU
size A3; DrawnBy: ThanhQuoc; Revision: V01; SheetNumber: 7; SheetTotal: 21; Project: RV1126 CAMERA BOARD DESIGN
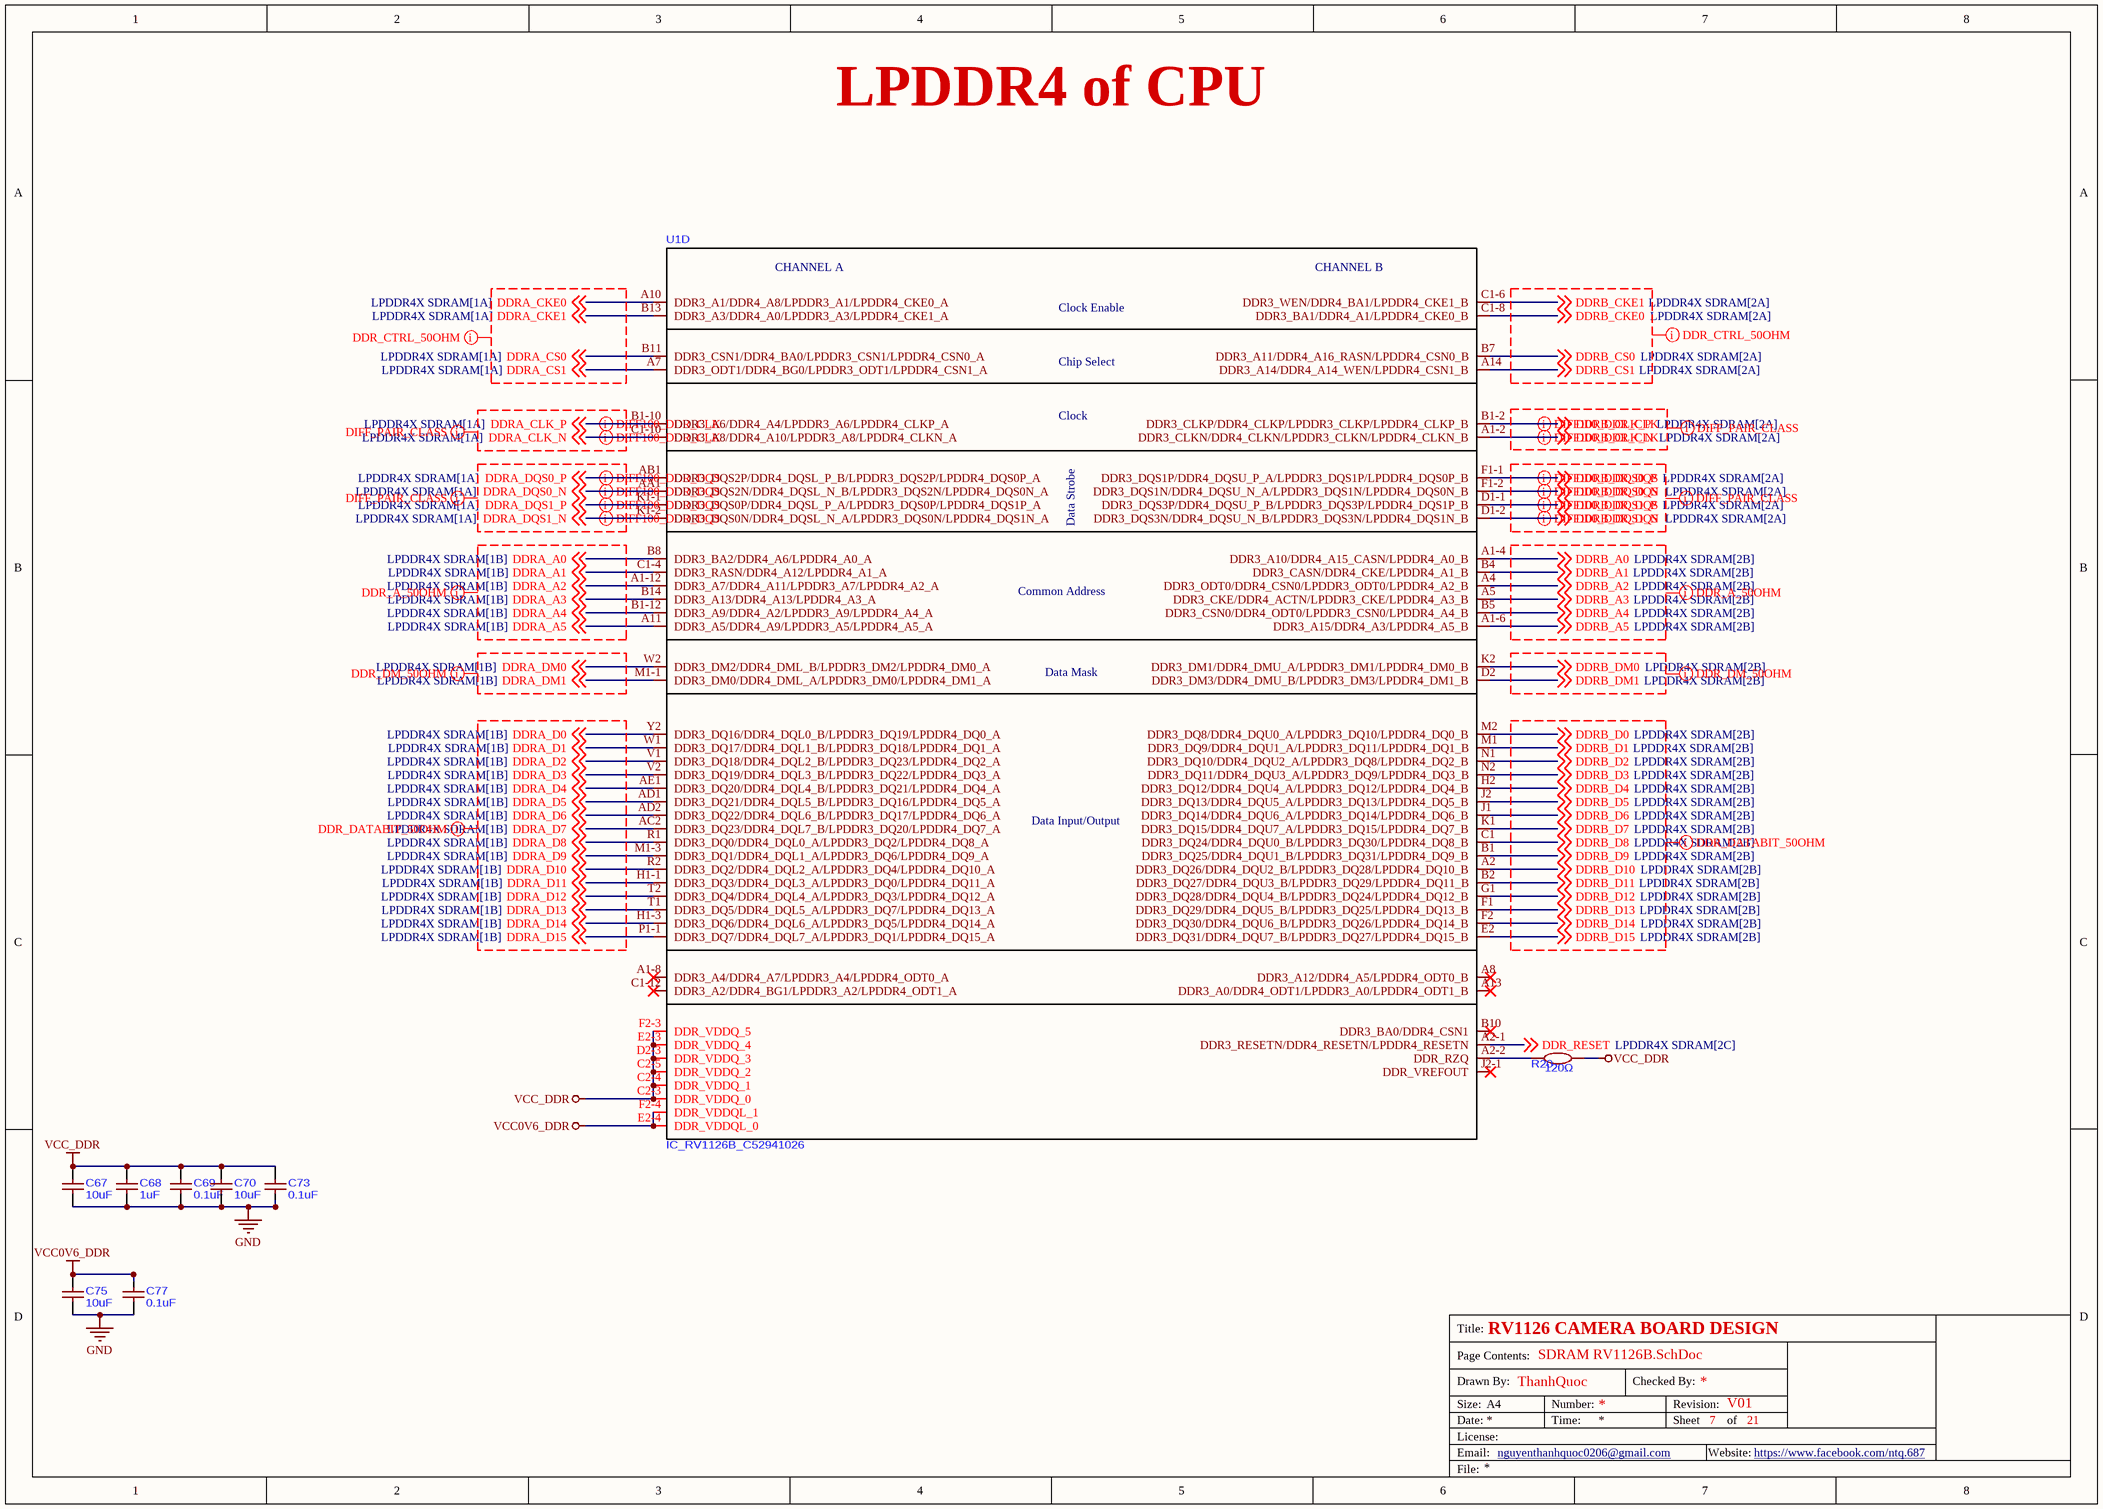
[diagram p6: SDRAM RV1126B.SchDoc]

### Parts
C67  10uF  [C0402]
C68  1uF  [C0201]
C69  0.1uF  [C0201]
C70  10uF  [C0402]
C73  0.1uF  [C0201]
C75  10uF  [C0402]
C77  0.1uF  [C0201]
R20  120Ω  [R0201]
U1  IC_RV1126B_C52941026  [CCSP-491_L14.0-W14.0-TL_RV1126B]  (part D of 18)

### Nets
GND: C67.1 C68.1 C69.1 C70.1 C73.1 C75.1 C77.1
VCC0V6_DDR: C75.2 C77.2 U1.E2-4(DDR_VDDQL_0) U1.F2-4(DDR_VDDQL_1)
VCC_DDR: C67.2 C68.2 C69.2 C70.2 C73.2 R20.1 U1.C2-3(DDR_VDDQ_0) U1.C2-4(DDR_VDDQ_1) U1.C2-5(DDR_VDDQ_2) U1.D2-3(DDR_VDDQ_3) U1.E2-3(DDR_VDDQ_4) U1.F2-3(DDR_VDDQ_5)
DDR_RESET: U1.A2-1(DDR3_RESETN/DDR4_RESETN/LPDDR4_RESETN) ; off-sheet DDR_RESET
DDRA_A0: U1.B8(DDR3_BA2/DDR4_A6/LPDDR4_A0_A) ; off-sheet DDRA_A0
DDRA_A1: U1.C1-4(DDR3_RASN/DDR4_A12/LPDDR4_A1_A) ; off-sheet DDRA_A1
DDRA_A2: U1.A1-12(DDR3_A7/DDR4_A11/LPDDR3_A7/LPDDR4_A2_A) ; off-sheet DDRA_A2
DDRA_A3: U1.B14(DDR3_A13/DDR4_A13/LPDDR4_A3_A) ; off-sheet DDRA_A3
DDRA_A4: U1.B1-12(DDR3_A9/DDR4_A2/LPDDR3_A9/LPDDR4_A4_A) ; off-sheet DDRA_A4
DDRA_A5: U1.A11(DDR3_A5/DDR4_A9/LPDDR3_A5/LPDDR4_A5_A) ; off-sheet DDRA_A5
DDRA_CKE0: U1.A10(DDR3_A1/DDR4_A8/LPDDR3_A1/LPDDR4_CKE0_A) ; off-sheet DDRA_CKE0
DDRA_CKE1: U1.B13(DDR3_A3/DDR4_A0/LPDDR3_A3/LPDDR4_CKE1_A) ; off-sheet DDRA_CKE1
DDRA_CLK_N: U1.C1-10(DDR3_A8/DDR4_A10/LPDDR3_A8/LPDDR4_CLKN_A) ; off-sheet DDRA_CLK_N
DDRA_CLK_P: U1.B1-10(DDR3_A6/DDR4_A4/LPDDR3_A6/LPDDR4_CLKP_A) ; off-sheet DDRA_CLK_P
DDRA_CS0: U1.B11(DDR3_CSN1/DDR4_BA0/LPDDR3_CSN1/LPDDR4_CSN0_A) ; off-sheet DDRA_CS0
DDRA_CS1: U1.A7(DDR3_ODT1/DDR4_BG0/LPDDR3_ODT1/LPDDR4_CSN1_A) ; off-sheet DDRA_CS1
DDRA_D0: U1.Y2(DDR3_DQ16/DDR4_DQL0_B/LPDDR3_DQ19/LPDDR4_DQ0_A) ; off-sheet DDRA_D0
DDRA_D1: U1.W1(DDR3_DQ17/DDR4_DQL1_B/LPDDR3_DQ18/LPDDR4_DQ1_A) ; off-sheet DDRA_D1
DDRA_D2: U1.V1(DDR3_DQ18/DDR4_DQL2_B/LPDDR3_DQ23/LPDDR4_DQ2_A) ; off-sheet DDRA_D2
DDRA_D3: U1.V2(DDR3_DQ19/DDR4_DQL3_B/LPDDR3_DQ22/LPDDR4_DQ3_A) ; off-sheet DDRA_D3
DDRA_D4: U1.AE1(DDR3_DQ20/DDR4_DQL4_B/LPDDR3_DQ21/LPDDR4_DQ4_A) ; off-sheet DDRA_D4
DDRA_D5: U1.AD1(DDR3_DQ21/DDR4_DQL5_B/LPDDR3_DQ16/LPDDR4_DQ5_A) ; off-sheet DDRA_D5
DDRA_D6: U1.AD2(DDR3_DQ22/DDR4_DQL6_B/LPDDR3_DQ17/LPDDR4_DQ6_A) ; off-sheet DDRA_D6
DDRA_D7: U1.AC2(DDR3_DQ23/DDR4_DQL7_B/LPDDR3_DQ20/LPDDR4_DQ7_A) ; off-sheet DDRA_D7
DDRA_D8: U1.R1(DDR3_DQ0/DDR4_DQL0_A/LPDDR3_DQ2/LPDDR4_DQ8_A) ; off-sheet DDRA_D8
DDRA_D9: U1.M1-3(DDR3_DQ1/DDR4_DQL1_A/LPDDR3_DQ6/LPDDR4_DQ9_A) ; off-sheet DDRA_D9
DDRA_D10: U1.R2(DDR3_DQ2/DDR4_DQL2_A/LPDDR3_DQ4/LPDDR4_DQ10_A) ; off-sheet DDRA_D10
DDRA_D11: U1.H1-1(DDR3_DQ3/DDR4_DQL3_A/LPDDR3_DQ0/LPDDR4_DQ11_A) ; off-sheet DDRA_D11
DDRA_D12: U1.T2(DDR3_DQ4/DDR4_DQL4_A/LPDDR3_DQ3/LPDDR4_DQ12_A) ; off-sheet DDRA_D12
DDRA_D13: U1.T1(DDR3_DQ5/DDR4_DQL5_A/LPDDR3_DQ7/LPDDR4_DQ13_A) ; off-sheet DDRA_D13
DDRA_D14: U1.H1-3(DDR3_DQ6/DDR4_DQL6_A/LPDDR3_DQ5/LPDDR4_DQ14_A) ; off-sheet DDRA_D14
DDRA_D15: U1.P1-1(DDR3_DQ7/DDR4_DQL7_A/LPDDR3_DQ1/LPDDR4_DQ15_A) ; off-sheet DDRA_D15
DDRA_DM0: U1.W2(DDR3_DM2/DDR4_DML_B/LPDDR3_DM2/LPDDR4_DM0_A) ; off-sheet DDRA_DM0
DDRA_DM1: U1.M1-1(DDR3_DM0/DDR4_DML_A/LPDDR3_DM0/LPDDR4_DM1_A) ; off-sheet DDRA_DM1
DDRA_DQS0_N: U1.AA1(DDR3_DQS2N/DDR4_DQSL_N_B/LPDDR3_DQS2N/LPDDR4_DQS0N_A) ; off-sheet DDRA_DQS0_N
DDRA_DQS0_P: U1.AB1(DDR3_DQS2P/DDR4_DQSL_P_B/LPDDR3_DQS2P/LPDDR4_DQS0P_A) ; off-sheet DDRA_DQS0_P
DDRA_DQS1_N: U1.K1-2(DDR3_DQS0N/DDR4_DQSL_N_A/LPDDR3_DQS0N/LPDDR4_DQS1N_A) ; off-sheet DDRA_DQS1_N
DDRA_DQS1_P: U1.K1-1(DDR3_DQS0P/DDR4_DQSL_P_A/LPDDR3_DQS0P/LPDDR4_DQS1P_A) ; off-sheet DDRA_DQS1_P
DDRB_A0: U1.A1-4(DDR3_A10/DDR4_A15_CASN/LPDDR4_A0_B) ; off-sheet DDRB_A0
DDRB_A1: U1.B4(DDR3_CASN/DDR4_CKE/LPDDR4_A1_B) ; off-sheet DDRB_A1
DDRB_A2: U1.A4(DDR3_ODT0/DDR4_CSN0/LPDDR3_ODT0/LPDDR4_A2_B) ; off-sheet DDRB_A2
DDRB_A3: U1.A5(DDR3_CKE/DDR4_ACTN/LPDDR3_CKE/LPDDR4_A3_B) ; off-sheet DDRB_A3
DDRB_A4: U1.B5(DDR3_CSN0/DDR4_ODT0/LPDDR3_CSN0/LPDDR4_A4_B) ; off-sheet DDRB_A4
DDRB_A5: U1.A1-6(DDR3_A15/DDR4_A3/LPDDR4_A5_B) ; off-sheet DDRB_A5
DDRB_CKE0: U1.C1-8(DDR3_BA1/DDR4_A1/LPDDR4_CKE0_B) ; off-sheet DDRB_CKE0
DDRB_CKE1: U1.C1-6(DDR3_WEN/DDR4_BA1/LPDDR4_CKE1_B) ; off-sheet DDRB_CKE1
DDRB_CLK_N: U1.A1-2(DDR3_CLKN/DDR4_CLKN/LPDDR3_CLKN/LPDDR4_CLKN_B) ; off-sheet DDRB_CLK_N
DDRB_CLK_P: U1.B1-2(DDR3_CLKP/DDR4_CLKP/LPDDR3_CLKP/LPDDR4_CLKP_B) ; off-sheet DDRB_CLK_P
DDRB_CS0: U1.B7(DDR3_A11/DDR4_A16_RASN/LPDDR4_CSN0_B) ; off-sheet DDRB_CS0
DDRB_CS1: U1.A14(DDR3_A14/DDR4_A14_WEN/LPDDR4_CSN1_B) ; off-sheet DDRB_CS1
DDRB_D0: U1.M2(DDR3_DQ8/DDR4_DQU0_A/LPDDR3_DQ10/LPDDR4_DQ0_B) ; off-sheet DDRB_D0
DDRB_D1: U1.M1(DDR3_DQ9/DDR4_DQU1_A/LPDDR3_DQ11/LPDDR4_DQ1_B) ; off-sheet DDRB_D1
DDRB_D2: U1.N1(DDR3_DQ10/DDR4_DQU2_A/LPDDR3_DQ8/LPDDR4_DQ2_B) ; off-sheet DDRB_D2
DDRB_D3: U1.N2(DDR3_DQ11/DDR4_DQU3_A/LPDDR3_DQ9/LPDDR4_DQ3_B) ; off-sheet DDRB_D3
DDRB_D4: U1.H2(DDR3_DQ12/DDR4_DQU4_A/LPDDR3_DQ12/LPDDR4_DQ4_B) ; off-sheet DDRB_D4
DDRB_D5: U1.J2(DDR3_DQ13/DDR4_DQU5_A/LPDDR3_DQ13/LPDDR4_DQ5_B) ; off-sheet DDRB_D5
DDRB_D6: U1.J1(DDR3_DQ14/DDR4_DQU6_A/LPDDR3_DQ14/LPDDR4_DQ6_B) ; off-sheet DDRB_D6
DDRB_D7: U1.K1(DDR3_DQ15/DDR4_DQU7_A/LPDDR3_DQ15/LPDDR4_DQ7_B) ; off-sheet DDRB_D7
DDRB_D8: U1.C1(DDR3_DQ24/DDR4_DQU0_B/LPDDR3_DQ30/LPDDR4_DQ8_B) ; off-sheet DDRB_D8
DDRB_D9: U1.B1(DDR3_DQ25/DDR4_DQU1_B/LPDDR3_DQ31/LPDDR4_DQ9_B) ; off-sheet DDRB_D9
DDRB_D10: U1.A2(DDR3_DQ26/DDR4_DQU2_B/LPDDR3_DQ28/LPDDR4_DQ10_B) ; off-sheet DDRB_D10
DDRB_D11: U1.B2(DDR3_DQ27/DDR4_DQU3_B/LPDDR3_DQ29/LPDDR4_DQ11_B) ; off-sheet DDRB_D11
DDRB_D12: U1.G1(DDR3_DQ28/DDR4_DQU4_B/LPDDR3_DQ24/LPDDR4_DQ12_B) ; off-sheet DDRB_D12
DDRB_D13: U1.F1(DDR3_DQ29/DDR4_DQU5_B/LPDDR3_DQ25/LPDDR4_DQ13_B) ; off-sheet DDRB_D13
DDRB_D14: U1.F2(DDR3_DQ30/DDR4_DQU6_B/LPDDR3_DQ26/LPDDR4_DQ14_B) ; off-sheet DDRB_D14
DDRB_D15: U1.E2(DDR3_DQ31/DDR4_DQU7_B/LPDDR3_DQ27/LPDDR4_DQ15_B) ; off-sheet DDRB_D15
DDRB_DM0: U1.K2(DDR3_DM1/DDR4_DMU_A/LPDDR3_DM1/LPDDR4_DM0_B) ; off-sheet DDRB_DM0
DDRB_DM1: U1.D2(DDR3_DM3/DDR4_DMU_B/LPDDR3_DM3/LPDDR4_DM1_B) ; off-sheet DDRB_DM1
DDRB_DQS0_N: U1.F1-2(DDR3_DQS1N/DDR4_DQSU_N_A/LPDDR3_DQS1N/LPDDR4_DQS0N_B) ; off-sheet DDRB_DQS0_N
DDRB_DQS0_P: U1.F1-1(DDR3_DQS1P/DDR4_DQSU_P_A/LPDDR3_DQS1P/LPDDR4_DQS0P_B) ; off-sheet DDRB_DQS0_P
DDRB_DQS1_N: U1.D1-2(DDR3_DQS3N/DDR4_DQSU_N_B/LPDDR3_DQS3N/LPDDR4_DQS1N_B) ; off-sheet DDRB_DQS1_N
DDRB_DQS1_P: U1.D1-1(DDR3_DQS3P/DDR4_DQSU_P_B/LPDDR3_DQS3P/LPDDR4_DQS1P_B) ; off-sheet DDRB_DQS1_P
NetR20_2: R20.2 U1.A2-2(DDR_RZQ)

Not connected (* = marked no-connect by the designer): U1 A1-8(DDR3_A4/DDR4_A7/LPDDR3_A4/LPDDR4_ODT0_A)* A8(DDR3_A12/DDR4_A5/LPDDR4_ODT0_B)* A13(DDR3_A0/DDR4_ODT1/LPDDR3_A0/LPDDR4_ODT1_B)* B10(DDR3_BA0/DDR4_CSN1)* C1-12(DDR3_A2/DDR4_BG1/LPDDR3_A2/LPDDR4_ODT1_A)* J2-1(DDR_VREFOUT)*

### Layout directives
net class DIFF_PAIR_CLASS: DDRA_CLK_N, DDRA_CLK_P, DDRA_DQS0_N, DDRA_DQS0_P, DDRA_DQS1_N, DDRA_DQS1_P, DDRB_CLK_N, DDRB_CLK_P, DDRB_DQS0_N, DDRB_DQS0_P, DDRB_DQS1_N, DDRB_DQS1_P
differential pair; differential pair class DIFF100_DDR_CLK: DDRA_CLK_N, DDRA_CLK_P, DDRB_CLK_N, DDRB_CLK_P
differential pair; differential pair class DIFF100_DDR_DQS: DDRA_DQS0_N, DDRA_DQS0_P, DDRA_DQS1_N, DDRA_DQS1_P, DDRB_DQS0_N, DDRB_DQS0_P, DDRB_DQS1_N, DDRB_DQS1_P
net class DDR_CTRL_50OHM: DDRA_CKE0, DDRA_CKE1, DDRA_CS0, DDRA_CS1, DDRB_CKE0, DDRB_CKE1, DDRB_CS0, DDRB_CS1
net class DDR_A_50OHM: DDRA_A0, DDRA_A1, DDRA_A2, DDRA_A3, DDRA_A4, DDRA_A5, DDRB_A0, DDRB_A1, DDRB_A2, DDRB_A3, DDRB_A4, DDRB_A5
net class DDR_DATABIT_50OHM: DDRA_D0, DDRA_D1, DDRA_D2, DDRA_D3, DDRA_D4, DDRA_D5, DDRA_D6, DDRA_D7, DDRA_D8, DDRA_D9, DDRA_D10, DDRA_D11, DDRA_D12, DDRA_D13, DDRA_D14, DDRA_D15, DDRB_D0, DDRB_D1, DDRB_D2, DDRB_D3, DDRB_D4, DDRB_D5, DDRB_D6, DDRB_D7, DDRB_D8, DDRB_D9, DDRB_D10, DDRB_D11, DDRB_D12, DDRB_D13, DDRB_D14, DDRB_D15
net class DDR_DM_50OHM: DDRA_DM0, DDRA_DM1, DDRB_DM0, DDRB_DM1

### Notes on the sheet
- Title:
- Drawn By:
- Page Contents:
- Checked By:
- Size:
- Date:
- File:
- License:
- Email:
- A4
- nguyenthanhquoc0206@gmail.com <=E-Mail>
- Number:
- Time:
- Revision:
- Sheet
- Website:
- of
- https://www.facebook.com/ntq.687
- (in symbol IC_RV1126B_C52941026, part D) CHANNEL A; CHANNEL B; Clock Enable; Chip Select; Clock; Data Strobe; Common Address; Data Mask; Data Input/Output

### Library data of the parts
C67 C70 C75 = CAP_10uF-10V-20%-0402: as C12 on sheet PWR_IN
C68 = CAP_1uF-6.3V-10%-0201: 1uF ±10% 6.3V Ceramic Capacitor X5R 0201
C69 C73 C77 = CAP_100nF-6.3V-10%-0201_1: as C42 on sheet Power Pins Page RV1126
R20 = RES_120-50mW-1%-0201: RES 120Ω ±1% 50mW 0201; ComponentLink1Description: LCSC; ComponentLink1URL: https://www.lcsc.com/product-detail/C295718.html?s_z=n_q_t_120%2520OHM&spm=wm.fly.bg.5.xh___wm.ssy.tc.1.tz&lcsc_vid=EwRWBFZSQVIPVFdUTlJfVldeFFRYUFQAElRYBFRRE1MxVlNeRFZeU1BfTlBYVzsOAxUeFF5JWBYZEEoKFBINSQcJGk4eFQsCAgIaSgADAwAHC0slRVhcV1ZTT08GEwkK

## Sheet LPDDR4X SDRAM.SchDoc: AS4C1G32MD4V-046BIN
size A4 portrait; DrawnBy: ThanhQuoc; Revision: V01; SheetNumber: 8; SheetTotal: 21; Project: RV1126 CAMERA BOARD DESIGN
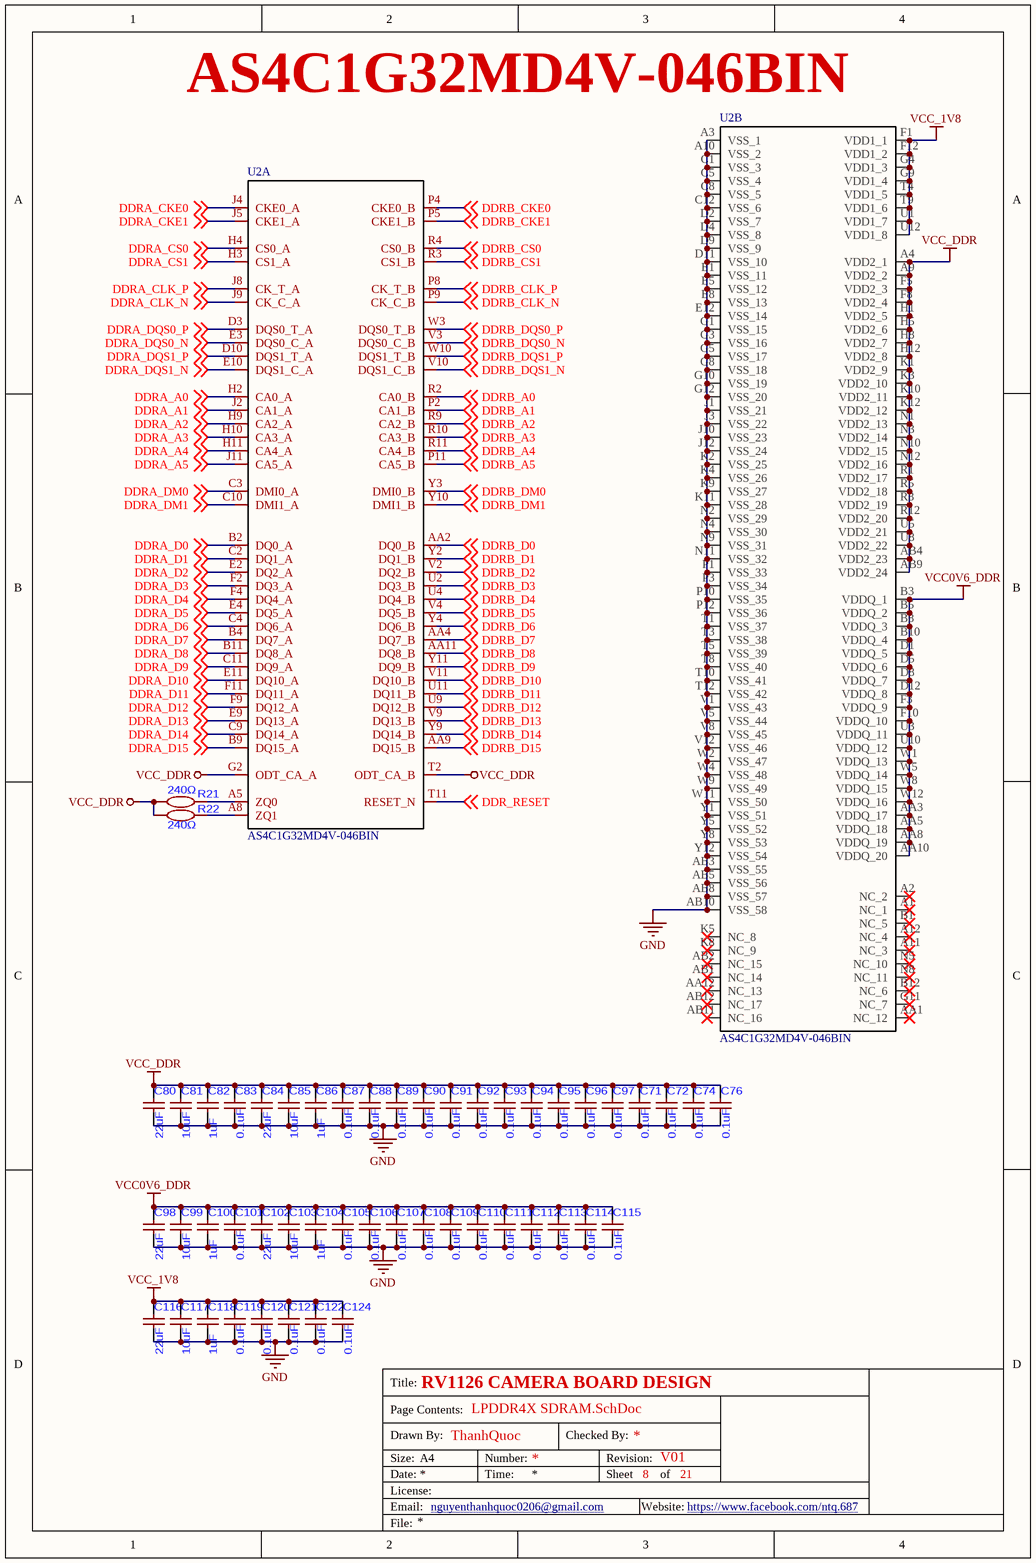
[diagram p7: LPDDR4X SDRAM.SchDoc]

### Parts
C71  0.1uF  [C0201]
C72  0.1uF  [C0201]
C74  0.1uF  [C0201]
C76  0.1uF  [C0201]
C80  22uF  [C0402]
C81  10uF  [C0402]
C82  1uF  [C0201]
C83  0.1uF  [C0201]
C84  22uF  [C0402]
C85  10uF  [C0402]
C86  1uF  [C0201]
C87  0.1uF  [C0201]
C88  0.1uF  [C0201]
C89  0.1uF  [C0201]
C90  0.1uF  [C0201]
C91  0.1uF  [C0201]
C92  0.1uF  [C0201]
C93  0.1uF  [C0201]
C94  0.1uF  [C0201]
C95  0.1uF  [C0201]
C96  0.1uF  [C0201]
C97  0.1uF  [C0201]
C98  22uF  [C0402]
C99  10uF  [C0402]
C100  1uF  [C0201]
C101  0.1uF  [C0201]
C102  22uF  [C0402]
C103  10uF  [C0402]
C104  1uF  [C0201]
C105  0.1uF  [C0201]
C106  0.1uF  [C0201]
C107  0.1uF  [C0201]
C108  0.1uF  [C0201]
C109  0.1uF  [C0201]
C110  0.1uF  [C0201]
C111  0.1uF  [C0201]
C112  0.1uF  [C0201]
C113  0.1uF  [C0201]
C114  0.1uF  [C0201]
C115  0.1uF  [C0201]
C116  22uF  [C0402]
C117  10uF  [C0402]
C118  1uF  [C0201]
C119  0.1uF  [C0201]
C120  0.1uF  [C0201]
C121  0.1uF  [C0201]
C122  0.1uF  [C0201]
C124  0.1uF  [C0201]
R21  240Ω  [R0201]
R22  240Ω  [R0201]
U2  AS4C1G32MD4V-046BIN  [BGA200C65P12X22_1000X1500X100]  (parts A,B of 2)

### Nets
GND: C71.1 C72.1 C74.1 C76.1 C80.1 C81.1 C82.1 C83.1 C84.1 C85.1 C86.1 C87.1 C88.1 C89.1 C90.1 C91.1 C92.1 C93.1 C94.1 C95.1 C96.1 C97.1 C98.1 C99.1 C100.1 C101.1 C102.1 C103.1 C104.1 C105.1 C106.1 C107.1 C108.1 C109.1 C110.1 C111.1 C112.1 C113.1 C114.1 C115.1 C116.1 C117.1 C118.1 C119.1 C120.1 C121.1 C122.1 C124.1 U2.A3(VSS_1) U2.A10(VSS_2) U2.AB3(VSS_55) U2.AB5(VSS_56) U2.AB8(VSS_57) U2.AB10(VSS_58) U2.C1(VSS_3) U2.C5(VSS_4) U2.C8(VSS_5) U2.C12(VSS_6) U2.D2(VSS_7) U2.D4(VSS_8) U2.D9(VSS_9) U2.D11(VSS_10) U2.E1(VSS_11) U2.E5(VSS_12) U2.E8(VSS_13) U2.E12(VSS_14) U2.G1(VSS_15) U2.G3(VSS_16) U2.G5(VSS_17) U2.G8(VSS_18) U2.G10(VSS_19) U2.G12(VSS_20) U2.J1(VSS_21) U2.J3(VSS_22) U2.J10(VSS_23) U2.J12(VSS_24) U2.K2(VSS_25) U2.K4(VSS_26) U2.K9(VSS_27) U2.K11(VSS_28) U2.N2(VSS_29) U2.N4(VSS_30) U2.N9(VSS_31) U2.N11(VSS_32) U2.P1(VSS_33) U2.P3(VSS_34) U2.P10(VSS_35) U2.P12(VSS_36) U2.T1(VSS_37) U2.T3(VSS_38) U2.T5(VSS_39) U2.T8(VSS_40) U2.T10(VSS_41) U2.T12(VSS_42) U2.V1(VSS_43) U2.V5(VSS_44) U2.V8(VSS_45) U2.V12(VSS_46) U2.W2(VSS_47) U2.W4(VSS_48) U2.W9(VSS_49) U2.W11(VSS_50) U2.Y1(VSS_51) U2.Y5(VSS_52) U2.Y8(VSS_53) U2.Y12(VSS_54)
VCC0V6_DDR: C98.2 C99.2 C100.2 C101.2 C102.2 C103.2 C104.2 C105.2 C106.2 C107.2 C108.2 C109.2 C110.2 C111.2 C112.2 C113.2 C114.2 C115.2 U2.AA3(VDDQ_17) U2.AA5(VDDQ_18) U2.AA8(VDDQ_19) U2.AA10(VDDQ_20) U2.B3(VDDQ_1) U2.B5(VDDQ_2) U2.B8(VDDQ_3) U2.B10(VDDQ_4) U2.D1(VDDQ_5) U2.D5(VDDQ_6) U2.D8(VDDQ_7) U2.D12(VDDQ_8) U2.F3(VDDQ_9) U2.F10(VDDQ_10) U2.U3(VDDQ_11) U2.U10(VDDQ_12) U2.W1(VDDQ_13) U2.W5(VDDQ_14) U2.W8(VDDQ_15) U2.W12(VDDQ_16)
VCC_1V8: C116.2 C117.2 C118.2 C119.2 C120.2 C121.2 C122.2 C124.2 U2.F1(VDD1_1) U2.F12(VDD1_2) U2.G4(VDD1_3) U2.G9(VDD1_4) U2.T4(VDD1_5) U2.T9(VDD1_6) U2.U1(VDD1_7) U2.U12(VDD1_8)
VCC_DDR: C71.2 C72.2 C74.2 C76.2 C80.2 C81.2 C82.2 C83.2 C84.2 C85.2 C86.2 C87.2 C88.2 C89.2 C90.2 C91.2 C92.2 C93.2 C94.2 C95.2 C96.2 C97.2 R21.1 R22.1 U2.A4(VDD2_1) U2.A9(VDD2_2) U2.AB4(VDD2_23) U2.AB9(VDD2_24) U2.F5(VDD2_3) U2.F8(VDD2_4) U2.G2(ODT_CA_A) U2.H1(VDD2_5) U2.H5(VDD2_6) U2.H8(VDD2_7) U2.H12(VDD2_8) U2.K1(VDD2_9) U2.K3(VDD2_10) U2.K10(VDD2_11) U2.K12(VDD2_12) U2.N1(VDD2_13) U2.N3(VDD2_14) U2.N10(VDD2_15) U2.N12(VDD2_16) U2.R1(VDD2_17) U2.R5(VDD2_18) U2.R8(VDD2_19) U2.R12(VDD2_20) U2.T2(ODT_CA_B) U2.U5(VDD2_21) U2.U8(VDD2_22)
DDR_RESET: U2.T11(RESET_N) ; off-sheet DDR_RESET
DDRA_A0: U2.H2(CA0_A) ; off-sheet DDRA_A0
DDRA_A1: U2.J2(CA1_A) ; off-sheet DDRA_A1
DDRA_A2: U2.H9(CA2_A) ; off-sheet DDRA_A2
DDRA_A3: U2.H10(CA3_A) ; off-sheet DDRA_A3
DDRA_A4: U2.H11(CA4_A) ; off-sheet DDRA_A4
DDRA_A5: U2.J11(CA5_A) ; off-sheet DDRA_A5
DDRA_CKE0: U2.J4(CKE0_A) ; off-sheet DDRA_CKE0
DDRA_CKE1: U2.J5(CKE1_A) ; off-sheet DDRA_CKE1
DDRA_CLK_N: U2.J9(CK_C_A) ; off-sheet DDRA_CLK_N
DDRA_CLK_P: U2.J8(CK_T_A) ; off-sheet DDRA_CLK_P
DDRA_CS0: U2.H4(CS0_A) ; off-sheet DDRA_CS0
DDRA_CS1: U2.H3(CS1_A) ; off-sheet DDRA_CS1
DDRA_D0: U2.B2(DQ0_A) ; off-sheet DDRA_D0
DDRA_D1: U2.C2(DQ1_A) ; off-sheet DDRA_D1
DDRA_D2: U2.E2(DQ2_A) ; off-sheet DDRA_D2
DDRA_D3: U2.F2(DQ3_A) ; off-sheet DDRA_D3
DDRA_D4: U2.F4(DQ4_A) ; off-sheet DDRA_D4
DDRA_D5: U2.E4(DQ5_A) ; off-sheet DDRA_D5
DDRA_D6: U2.C4(DQ6_A) ; off-sheet DDRA_D6
DDRA_D7: U2.B4(DQ7_A) ; off-sheet DDRA_D7
DDRA_D8: U2.B11(DQ8_A) ; off-sheet DDRA_D8
DDRA_D9: U2.C11(DQ9_A) ; off-sheet DDRA_D9
DDRA_D10: U2.E11(DQ10_A) ; off-sheet DDRA_D10
DDRA_D11: U2.F11(DQ11_A) ; off-sheet DDRA_D11
DDRA_D12: U2.F9(DQ12_A) ; off-sheet DDRA_D12
DDRA_D13: U2.E9(DQ13_A) ; off-sheet DDRA_D13
DDRA_D14: U2.C9(DQ14_A) ; off-sheet DDRA_D14
DDRA_D15: U2.B9(DQ15_A) ; off-sheet DDRA_D15
DDRA_DM0: U2.C3(DMI0_A) ; off-sheet DDRA_DM0
DDRA_DM1: U2.C10(DMI1_A) ; off-sheet DDRA_DM1
DDRA_DQS0_N: U2.E3(DQS0_C_A) ; off-sheet DDRA_DQS0_N
DDRA_DQS0_P: U2.D3(DQS0_T_A) ; off-sheet DDRA_DQS0_P
DDRA_DQS1_N: U2.E10(DQS1_C_A) ; off-sheet DDRA_DQS1_N
DDRA_DQS1_P: U2.D10(DQS1_T_A) ; off-sheet DDRA_DQS1_P
DDRB_A0: U2.R2(CA0_B) ; off-sheet DDRB_A0
DDRB_A1: U2.P2(CA1_B) ; off-sheet DDRB_A1
DDRB_A2: U2.R9(CA2_B) ; off-sheet DDRB_A2
DDRB_A3: U2.R10(CA3_B) ; off-sheet DDRB_A3
DDRB_A4: U2.R11(CA4_B) ; off-sheet DDRB_A4
DDRB_A5: U2.P11(CA5_B) ; off-sheet DDRB_A5
DDRB_CKE0: U2.P4(CKE0_B) ; off-sheet DDRB_CKE0
DDRB_CKE1: U2.P5(CKE1_B) ; off-sheet DDRB_CKE1
DDRB_CLK_N: U2.P9(CK_C_B) ; off-sheet DDRB_CLK_N
DDRB_CLK_P: U2.P8(CK_T_B) ; off-sheet DDRB_CLK_P
DDRB_CS0: U2.R4(CS0_B) ; off-sheet DDRB_CS0
DDRB_CS1: U2.R3(CS1_B) ; off-sheet DDRB_CS1
DDRB_D0: U2.AA2(DQ0_B) ; off-sheet DDRB_D0
DDRB_D1: U2.Y2(DQ1_B) ; off-sheet DDRB_D1
DDRB_D2: U2.V2(DQ2_B) ; off-sheet DDRB_D2
DDRB_D3: U2.U2(DQ3_B) ; off-sheet DDRB_D3
DDRB_D4: U2.U4(DQ4_B) ; off-sheet DDRB_D4
DDRB_D5: U2.V4(DQ5_B) ; off-sheet DDRB_D5
DDRB_D6: U2.Y4(DQ6_B) ; off-sheet DDRB_D6
DDRB_D7: U2.AA4(DQ7_B) ; off-sheet DDRB_D7
DDRB_D8: U2.AA11(DQ8_B) ; off-sheet DDRB_D8
DDRB_D9: U2.Y11(DQ9_B) ; off-sheet DDRB_D9
DDRB_D10: U2.V11(DQ10_B) ; off-sheet DDRB_D10
DDRB_D11: U2.U11(DQ11_B) ; off-sheet DDRB_D11
DDRB_D12: U2.U9(DQ12_B) ; off-sheet DDRB_D12
DDRB_D13: U2.V9(DQ13_B) ; off-sheet DDRB_D13
DDRB_D14: U2.Y9(DQ14_B) ; off-sheet DDRB_D14
DDRB_D15: U2.AA9(DQ15_B) ; off-sheet DDRB_D15
DDRB_DM0: U2.Y3(DMI0_B) ; off-sheet DDRB_DM0
DDRB_DM1: U2.Y10(DMI1_B) ; off-sheet DDRB_DM1
DDRB_DQS0_N: U2.V3(DQS0_C_B) ; off-sheet DDRB_DQS0_N
DDRB_DQS0_P: U2.W3(DQS0_T_B) ; off-sheet DDRB_DQS0_P
DDRB_DQS1_N: U2.V10(DQS1_C_B) ; off-sheet DDRB_DQS1_N
DDRB_DQS1_P: U2.W10(DQS1_T_B) ; off-sheet DDRB_DQS1_P
NetR21_2: R21.2 U2.A5(ZQ0)
NetR22_2: R22.2 U2.A8(ZQ1)

Not connected (* = marked no-connect by the designer): U2 A1(NC_1)* A2(NC_2)* A11(NC_3)* A12(NC_4)* AA1(NC_12)* AA12(NC_13)* AB1(NC_14)* AB2(NC_15)* AB11(NC_16)* AB12(NC_17)* B1(NC_5)* B12(NC_6)* G11(NC_7)* K5(NC_8)* K8(NC_9)* N5(NC_10)* N8(NC_11)*

### Notes on the sheet
- Title:
- Drawn By:
- Page Contents:
- Checked By:
- Size:
- Date:
- File:
- License:
- Email:
- A4
- nguyenthanhquoc0206@gmail.com
- Number:
- Time:
- Revision:
- Sheet
- Website:
- of
- https://www.facebook.com/ntq.687

### Library data of the parts
C71 C72 C74 C76 C83 C87-C97 C101 C105-C115 C119-C122 C124 = CAP_100nF-6.3V-10%-0201_1: as C42 on sheet Power Pins Page RV1126
C80 C84 C98 C102 C116 = CAP_22uF-6.3V-20%-0402: 22uF X5R ±20% 6.3V 0402 Ceramic Capacitors RoHS; ComponentLink1Description: LCSC; ComponentLink1URL: https://www.lcsc.com/product-detail/C385994.html?s_z=n_q_t_22UF&spm=wm.fly.bg.2.xh___wm.ssy.tc.2.tz&lcsc_vid=EwRWBFZSQVIPVFdUTlJfVldeFFRYUFQAElRYBFRRE1MxVlNeRFZbX1BRRVlbVDsOAxUeFF5JWBYZEEoKFBINSQcJGk4NBhADEA4cHktXRlhXSQwSGg0%3D
C81 C85 C99 C103 C117 = CAP_10uF-10V-20%-0402: as C12 on sheet PWR_IN
C82 C86 C100 C104 C118 = CAP_1uF-6.3V-10%-0201: 1uF ±10% 6.3V Ceramic Capacitor X5R 0201
R21 R22 = RES_240-0.063W-1%-0201: RES 240Ω ±1% 50mW 0201; ComponentLink1Description: LCSC; ComponentLink1URL: https://www.lcsc.com/product-detail/C155745.html?s_z=n_q_t_240%2520OHM&spm=wm.fly.bg.0.xh___wm.ssy.tc.0.tz&lcsc_vid=EwRWBFZSQVIPVFdUTlJfVldeFFRYUFQAElRYBFRRE1MxVlNeRFdWVFBQTlZbVTsOAxUeFF5JWBYZEEoKFBINSQcJGk4dAgUUFAk%3D
U2 = AS4C1G32MD4V-046BIN: DRAM LPDDR4X, 32Gb, 1G X 32, 0.6v, 200ball TFBGA,2133MHZ,industrial Temp; Manufacturer_Name: Alliance Memory; Geometry.Height: 1mm; Manufacturer_Part_Number: AS4C1G32MD4V-046BIN; Mouser Part Number: 913-AS4C1G32MD4046BI; Mouser Price/Stock: https://www.mouser.co.uk/ProductDetail/Alliance-Memory/AS4C1G32MD4V-046BIN?qs=2wMNvWM5ZX7JcOV9cKEgAg%3D%3D; Arrow Part Number: *; Arrow Price/Stock: *; Datasheet Link: https://www.alliancememory.com/wp-content/uploads/pdf/ddr4/AllianceMemory_8Gb_16Gb_32Gb_LPDDR4X_AS4C512M16MD4V_AS4C512M32MD4V_AS4C1G32MD4V.pdf

## Sheet RV1126B EMMC.SchDoc: EMMC OF CPU
size A4; DrawnBy: ThanhQuoc; Revision: V01; SheetNumber: 9; SheetTotal: 21; Project: RV1126 CAMERA BOARD DESIGN
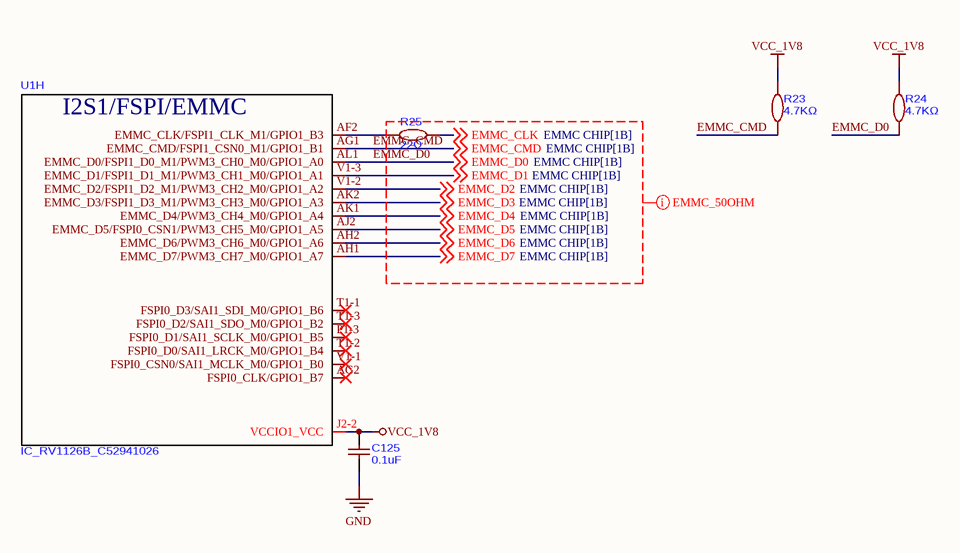
[diagram p8: RV1126B EMMC.SchDoc]

### Parts
C125  0.1uF  [C0201]
R23  4.7KΩ  [R0201]
R24  4.7KΩ  [R0201]
R25  22Ω  [R0201]
U1  IC_RV1126B_C52941026  [CCSP-491_L14.0-W14.0-TL_RV1126B]  (part H of 18)

### Nets
GND: C125.1
VCC_1V8: C125.2 R23.2 R24.2 U1.J2-2(VCCIO1_VCC)
EMMC_CLK: R25.2 ; off-sheet EMMC_CLK
EMMC_CMD: R23.1 U1.AG1(EMMC_CMD/FSPI1_CSN0_M1/GPIO1_B1) ; off-sheet EMMC_CMD
EMMC_D0: R24.1 U1.AL1(EMMC_D0/FSPI1_D0_M1/PWM3_CH0_M0/GPIO1_A0) ; off-sheet EMMC_D0
EMMC_D1: U1.V1-3(EMMC_D1/FSPI1_D1_M1/PWM3_CH1_M0/GPIO1_A1) ; off-sheet EMMC_D1
EMMC_D2: U1.V1-2(EMMC_D2/FSPI1_D2_M1/PWM3_CH2_M0/GPIO1_A2) ; off-sheet EMMC_D2
EMMC_D3: U1.AK2(EMMC_D3/FSPI1_D3_M1/PWM3_CH3_M0/GPIO1_A3) ; off-sheet EMMC_D3
EMMC_D4: U1.AK1(EMMC_D4/PWM3_CH4_M0/GPIO1_A4) ; off-sheet EMMC_D4
EMMC_D5: U1.AJ2(EMMC_D5/FSPI0_CSN1/PWM3_CH5_M0/GPIO1_A5) ; off-sheet EMMC_D5
EMMC_D6: U1.AH2(EMMC_D6/PWM3_CH6_M0/GPIO1_A6) ; off-sheet EMMC_D6
EMMC_D7: U1.AH1(EMMC_D7/PWM3_CH7_M0/GPIO1_A7) ; off-sheet EMMC_D7
NetR25_1: R25.1 U1.AF2(EMMC_CLK/FSPI1_CLK_M1/GPIO1_B3)

Not connected (* = marked no-connect by the designer): U1 AG2(FSPI0_CLK/GPIO1_B7)* P1-3(FSPI0_D1/SAI1_SCLK_M0/GPIO1_B5)* T1-1(FSPI0_D3/SAI1_SDI_M0/GPIO1_B6)* T1-2(FSPI0_D0/SAI1_LRCK_M0/GPIO1_B4)* T1-3(FSPI0_D2/SAI1_SDO_M0/GPIO1_B2)* V1-1(FSPI0_CSN0/SAI1_MCLK_M0/GPIO1_B0)*

### Layout directives
net class EMMC_50OHM: EMMC_CLK, EMMC_CMD, EMMC_D0, EMMC_D1, EMMC_D2, EMMC_D3, EMMC_D4, EMMC_D5, EMMC_D6, EMMC_D7

### Notes on the sheet
- Title:
- Drawn By:
- Page Contents:
- Checked By:
- Size:
- Date:
- File:
- License:
- Email:
- A4
- nguyenthanhquoc0206@gmail.com
- Number:
- Time:
- Revision:
- Sheet
- Website:
- of
- https://www.facebook.com/ntq.687
- (in symbol IC_RV1126B_C52941026, part H) I2S1/FSPI/EMMC

### Library data of the parts
C125 = CAP_100nF-6.3V-10%-0201_1: as C42 on sheet Power Pins Page RV1126
R23 R24 = RES_4.7K-50mW-1%-0201: RES 4.7kΩ ±1% 50mW 0201; ComponentLink1Description: LCSC; ComponentLink1URL: https://www.lcsc.com/product-detail/C295718.html?s_z=n_q_t_120%2520OHM&spm=wm.fly.bg.5.xh___wm.ssy.tc.1.tz&lcsc_vid=EwRWBFZSQVIPVFdUTlJfVldeFFRYUFQAElRYBFRRE1MxVlNeRFZeU1BfTlBYVzsOAxUeFF5JWBYZEEoKFBINSQcJGk4eFQsCAgIaSgADAwAHC0slRVhcV1ZTT08GEwkK
R25 = RES_22-50mW-1%-0201: RES 22Ω ±1% 50mW 0201; ComponentLink1Description: LCSC; ComponentLink1URL: https://www.lcsc.com/product-detail/C295718.html?s_z=n_q_t_120%2520OHM&spm=wm.fly.bg.5.xh___wm.ssy.tc.1.tz&lcsc_vid=EwRWBFZSQVIPVFdUTlJfVldeFFRYUFQAElRYBFRRE1MxVlNeRFZeU1BfTlBYVzsOAxUeFF5JWBYZEEoKFBINSQcJGk4eFQsCAgIaSgADAwAHC0slRVhcV1ZTT08GEwkK

## Sheet EMMC CHIP.SchDoc: EMMC KLMAG1JETD-B041
size A4; DrawnBy: ThanhQuoc; Revision: V01; SheetNumber: 10; SheetTotal: 21; Project: RV1126 CAMERA BOARD DESIGN
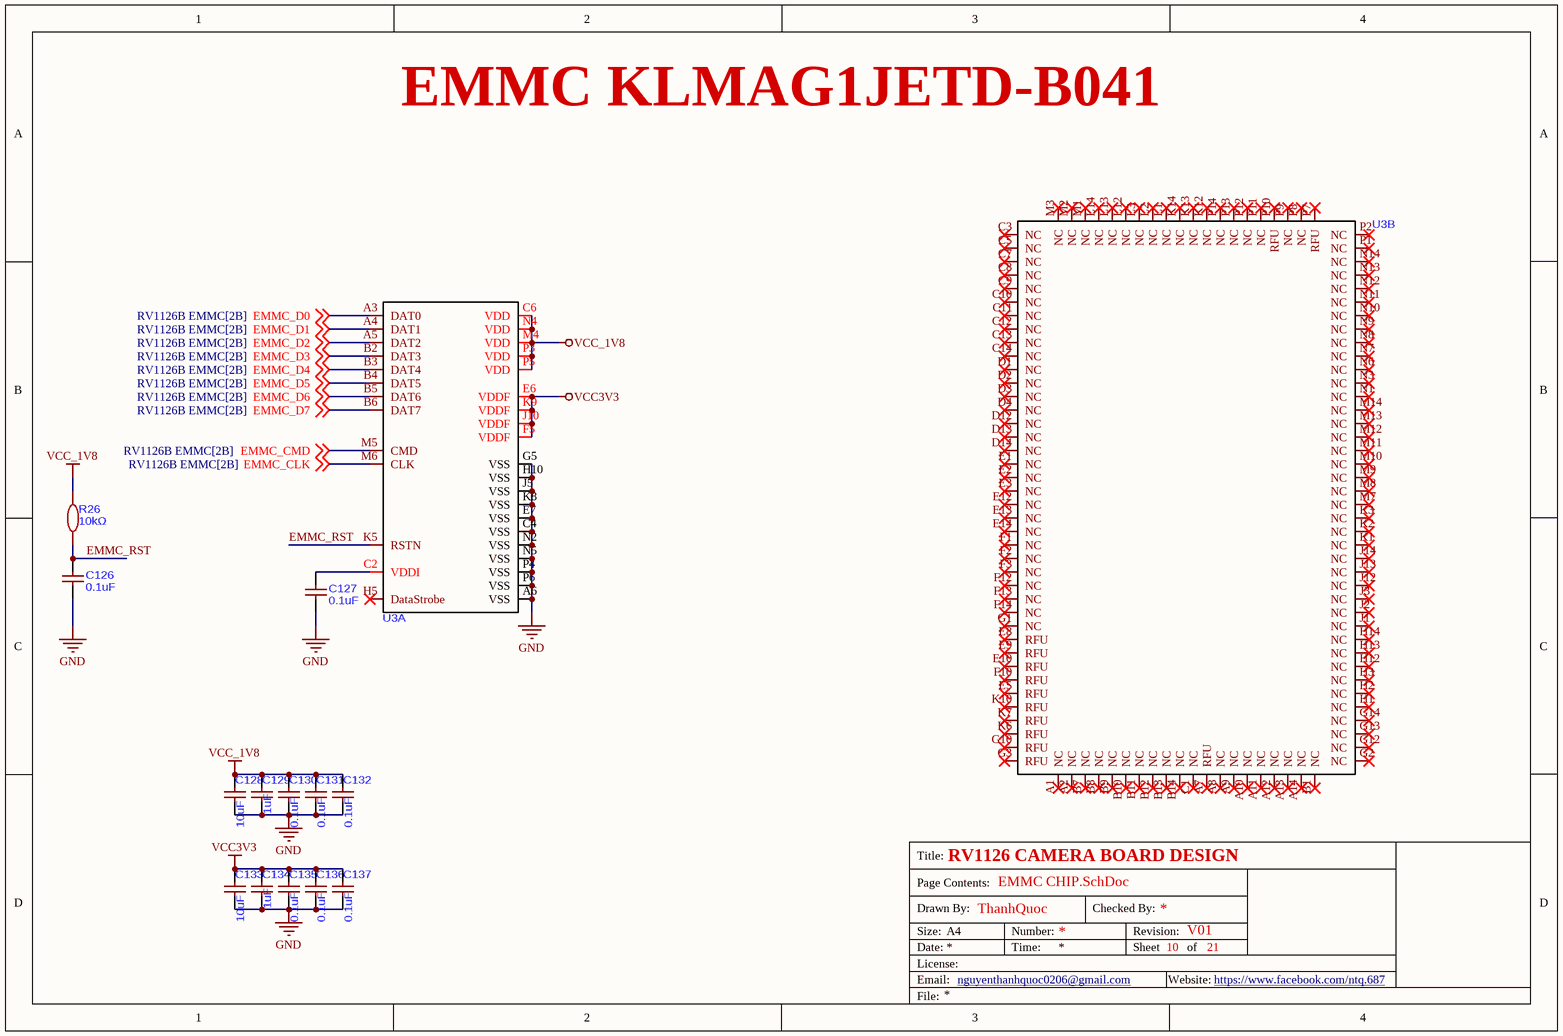
[diagram p9: EMMC CHIP.SchDoc]

### Parts
C126  0.1uF  [C0201]
C127  0.1uF  [C0201]
C128  10uF  [C0402]
C129  1uF  [C0201]
C130  0.1uF  [C0201]
C131  0.1uF  [C0201]
C132  0.1uF  [C0201]
C133  10uF  [C0402]
C134  1uF  [C0201]
C135  0.1uF  [C0201]
C136  0.1uF  [C0201]
C137  0.1uF  [C0201]
R26  10kΩ  [R0201]
U3  emmc 16gb  [FBGA-153_L13.0-W11.5-P0.50_KLMAG1JETD-B041]  (value not drawn)  (parts A,B of 2)

### Nets
GND: C126.1 C127.1 C128.1 C129.1 C130.1 C131.1 C132.1 C133.1 C134.1 C135.1 C136.1 C137.1 U3.A6(VSS) U3.C4(VSS) U3.E7(VSS) U3.G5(VSS) U3.H10(VSS) U3.J5(VSS) U3.K8(VSS) U3.N2(VSS) U3.N5(VSS) U3.P4(VSS) U3.P6(VSS)
VCC3V3: C133.2 C134.2 C135.2 C136.2 C137.2 U3.E6(VDDF) U3.F5(VDDF) U3.J10(VDDF) U3.K9(VDDF)
VCC_1V8: C128.2 C129.2 C130.2 C131.2 C132.2 R26.2 U3.C6(VDD) U3.M4(VDD) U3.N4(VDD) U3.P3(VDD) U3.P5(VDD)
EMMC_CLK: U3.M6(CLK) ; off-sheet EMMC_CLK
EMMC_CMD: U3.M5(CMD) ; off-sheet EMMC_CMD
EMMC_D0: U3.A3(DAT0) ; off-sheet EMMC_D0
EMMC_D1: U3.A4(DAT1) ; off-sheet EMMC_D1
EMMC_D2: U3.A5(DAT2) ; off-sheet EMMC_D2
EMMC_D3: U3.B2(DAT3) ; off-sheet EMMC_D3
EMMC_D4: U3.B3(DAT4) ; off-sheet EMMC_D4
EMMC_D5: U3.B4(DAT5) ; off-sheet EMMC_D5
EMMC_D6: U3.B5(DAT6) ; off-sheet EMMC_D6
EMMC_D7: U3.B6(DAT7) ; off-sheet EMMC_D7
EMMC_RST: C126.2 R26.1 U3.K5(RSTN)
NetC127_2: C127.2 U3.C2(VDDI)

Not connected (* = marked no-connect by the designer): U3 A1(NC)* A2(NC)* A7(RFU)* A8(NC)* A9(NC)* A10(NC)* A11(NC)* A12(NC)* A13(NC)* A14(NC)* B1(NC)* B7(NC)* B8(NC)* B9(NC)* B10(NC)* B11(NC)* B12(NC)* B13(NC)* B14(NC)* C1(NC)* C3(NC)* C5(NC)* C7(NC)* C8(NC)* C9(NC)* C10(NC)* C11(NC)* C12(NC)* C13(NC)* C14(NC)* D1(NC)* D2(NC)* D3(NC)* D4(NC)* D12(NC)* D13(NC)* D14(NC)* E1(NC)* E2(NC)* E3(NC)* E5(RFU)* E8(RFU)* E9(RFU)* E10(RFU)* E12(NC)* E13(NC)* E14(NC)* F1(NC)* F2(NC)* F3(NC)* F10(RFU)* F12(NC)* F13(NC)* F14(NC)* G1(NC)* G2(NC)* G3(RFU)* G10(RFU)* G12(NC)* G13(NC)* G14(NC)* H1(NC)* H2(NC)* H3(NC)* H5(DataStrobe)* H12(NC)* H13(NC)* H14(NC)* J1(NC)* J2(NC)* J3(NC)* J12(NC)* J13(NC)* J14(NC)* K1(NC)* K2(NC)* K3(NC)* K6(RFU)* K7(RFU)* K10(RFU)* K12(NC)* K13(NC)* K14(NC)* L1(NC)* L2(NC)* L3(NC)* L12(NC)* L13(NC)* L14(NC)* M1(NC)* M2(NC)* M3(NC)* M7(NC)* M8(NC)* M9(NC)* M10(NC)* M11(NC)* M12(NC)* M13(NC)* M14(NC)* N1(NC)* N3(NC)* N6(NC)* N7(NC)* N8(NC)* N9(NC)* N10(NC)* N11(NC)* N12(NC)* N13(NC)* N14(NC)* P1(NC)* P2(NC)* P7(RFU)* P8(NC)* P9(NC)* P10(RFU)* P11(NC)* P12(NC)* P13(NC)* P14(NC)*

### Notes on the sheet
- Title:
- Drawn By:
- Page Contents:
- Checked By:
- Size:
- Date:
- File:
- License:
- Email:
- A4
- nguyenthanhquoc0206@gmail.com
- Number:
- Time:
- Revision:
- Sheet
- Website:
- of
- https://www.facebook.com/ntq.687

### Library data of the parts
C126 C127 C130-C132 C135-C137 = CAP_100nF-6.3V-10%-0201_1: as C42 on sheet Power Pins Page RV1126
C128 C133 = CAP_10uF-10V-20%-0402: as C12 on sheet PWR_IN
C129 C134 = CAP_1uF-6.3V-10%-0201: 1uF ±10% 6.3V Ceramic Capacitor X5R 0201
R26 = RES_10K-50mW-1%-0201: RES 10KΩ ±1% 50mW 0201; ComponentLink1Description: LCSC; ComponentLink1URL: https://www.lcsc.com/product-detail/C93949.html?spm=wm.fly.bg.0.xh&lcsc_vid=EwRWBFZSQVIPVFdUTlJfVldeFFRYUFQAElRYBFRRE1MxVlNeRVlXUFNQQ1RWXjsOAxUeFF5JWBYZEEoKFBINSQcJGk4eFQsCAgIaSgADAwAHC0slRlVYUFFIHxUDCw%3D%3D
U3 = KLMAG1JETD-B041: eMMC 5.1 Specification compatibility